# EAGLE schematic BMS (EAGLE 6.4)

## Sheet 1 of 8: LTC-6803-4 Circuit
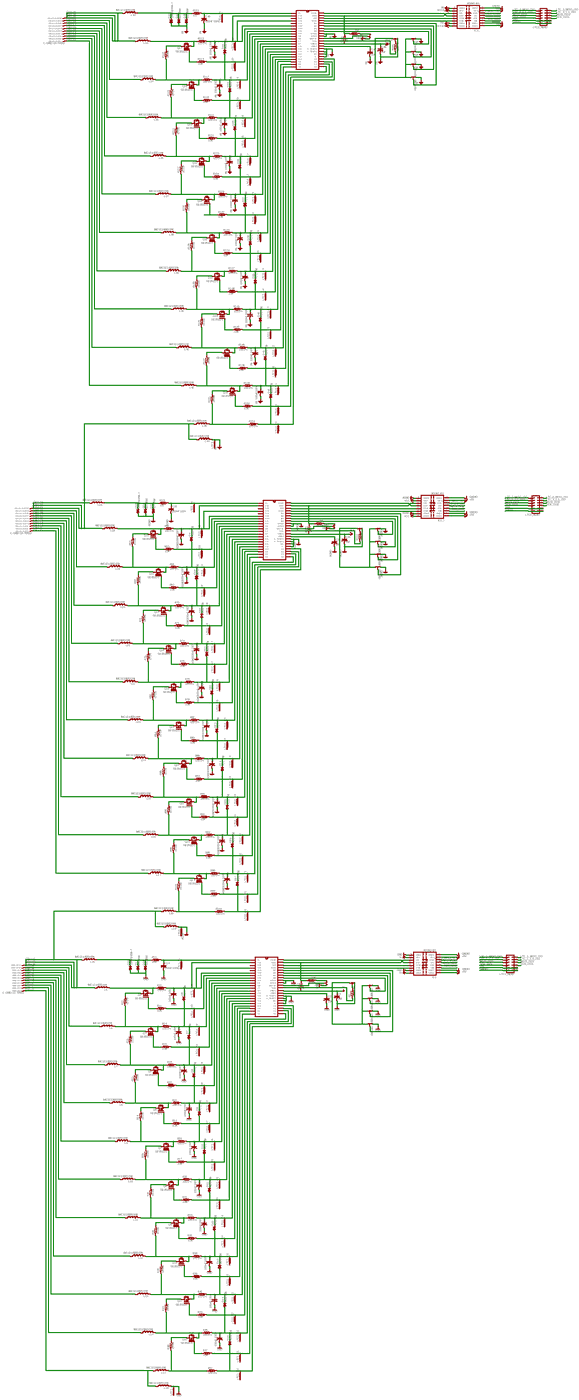
[diagram p0: schematic, sheet 1, overview]
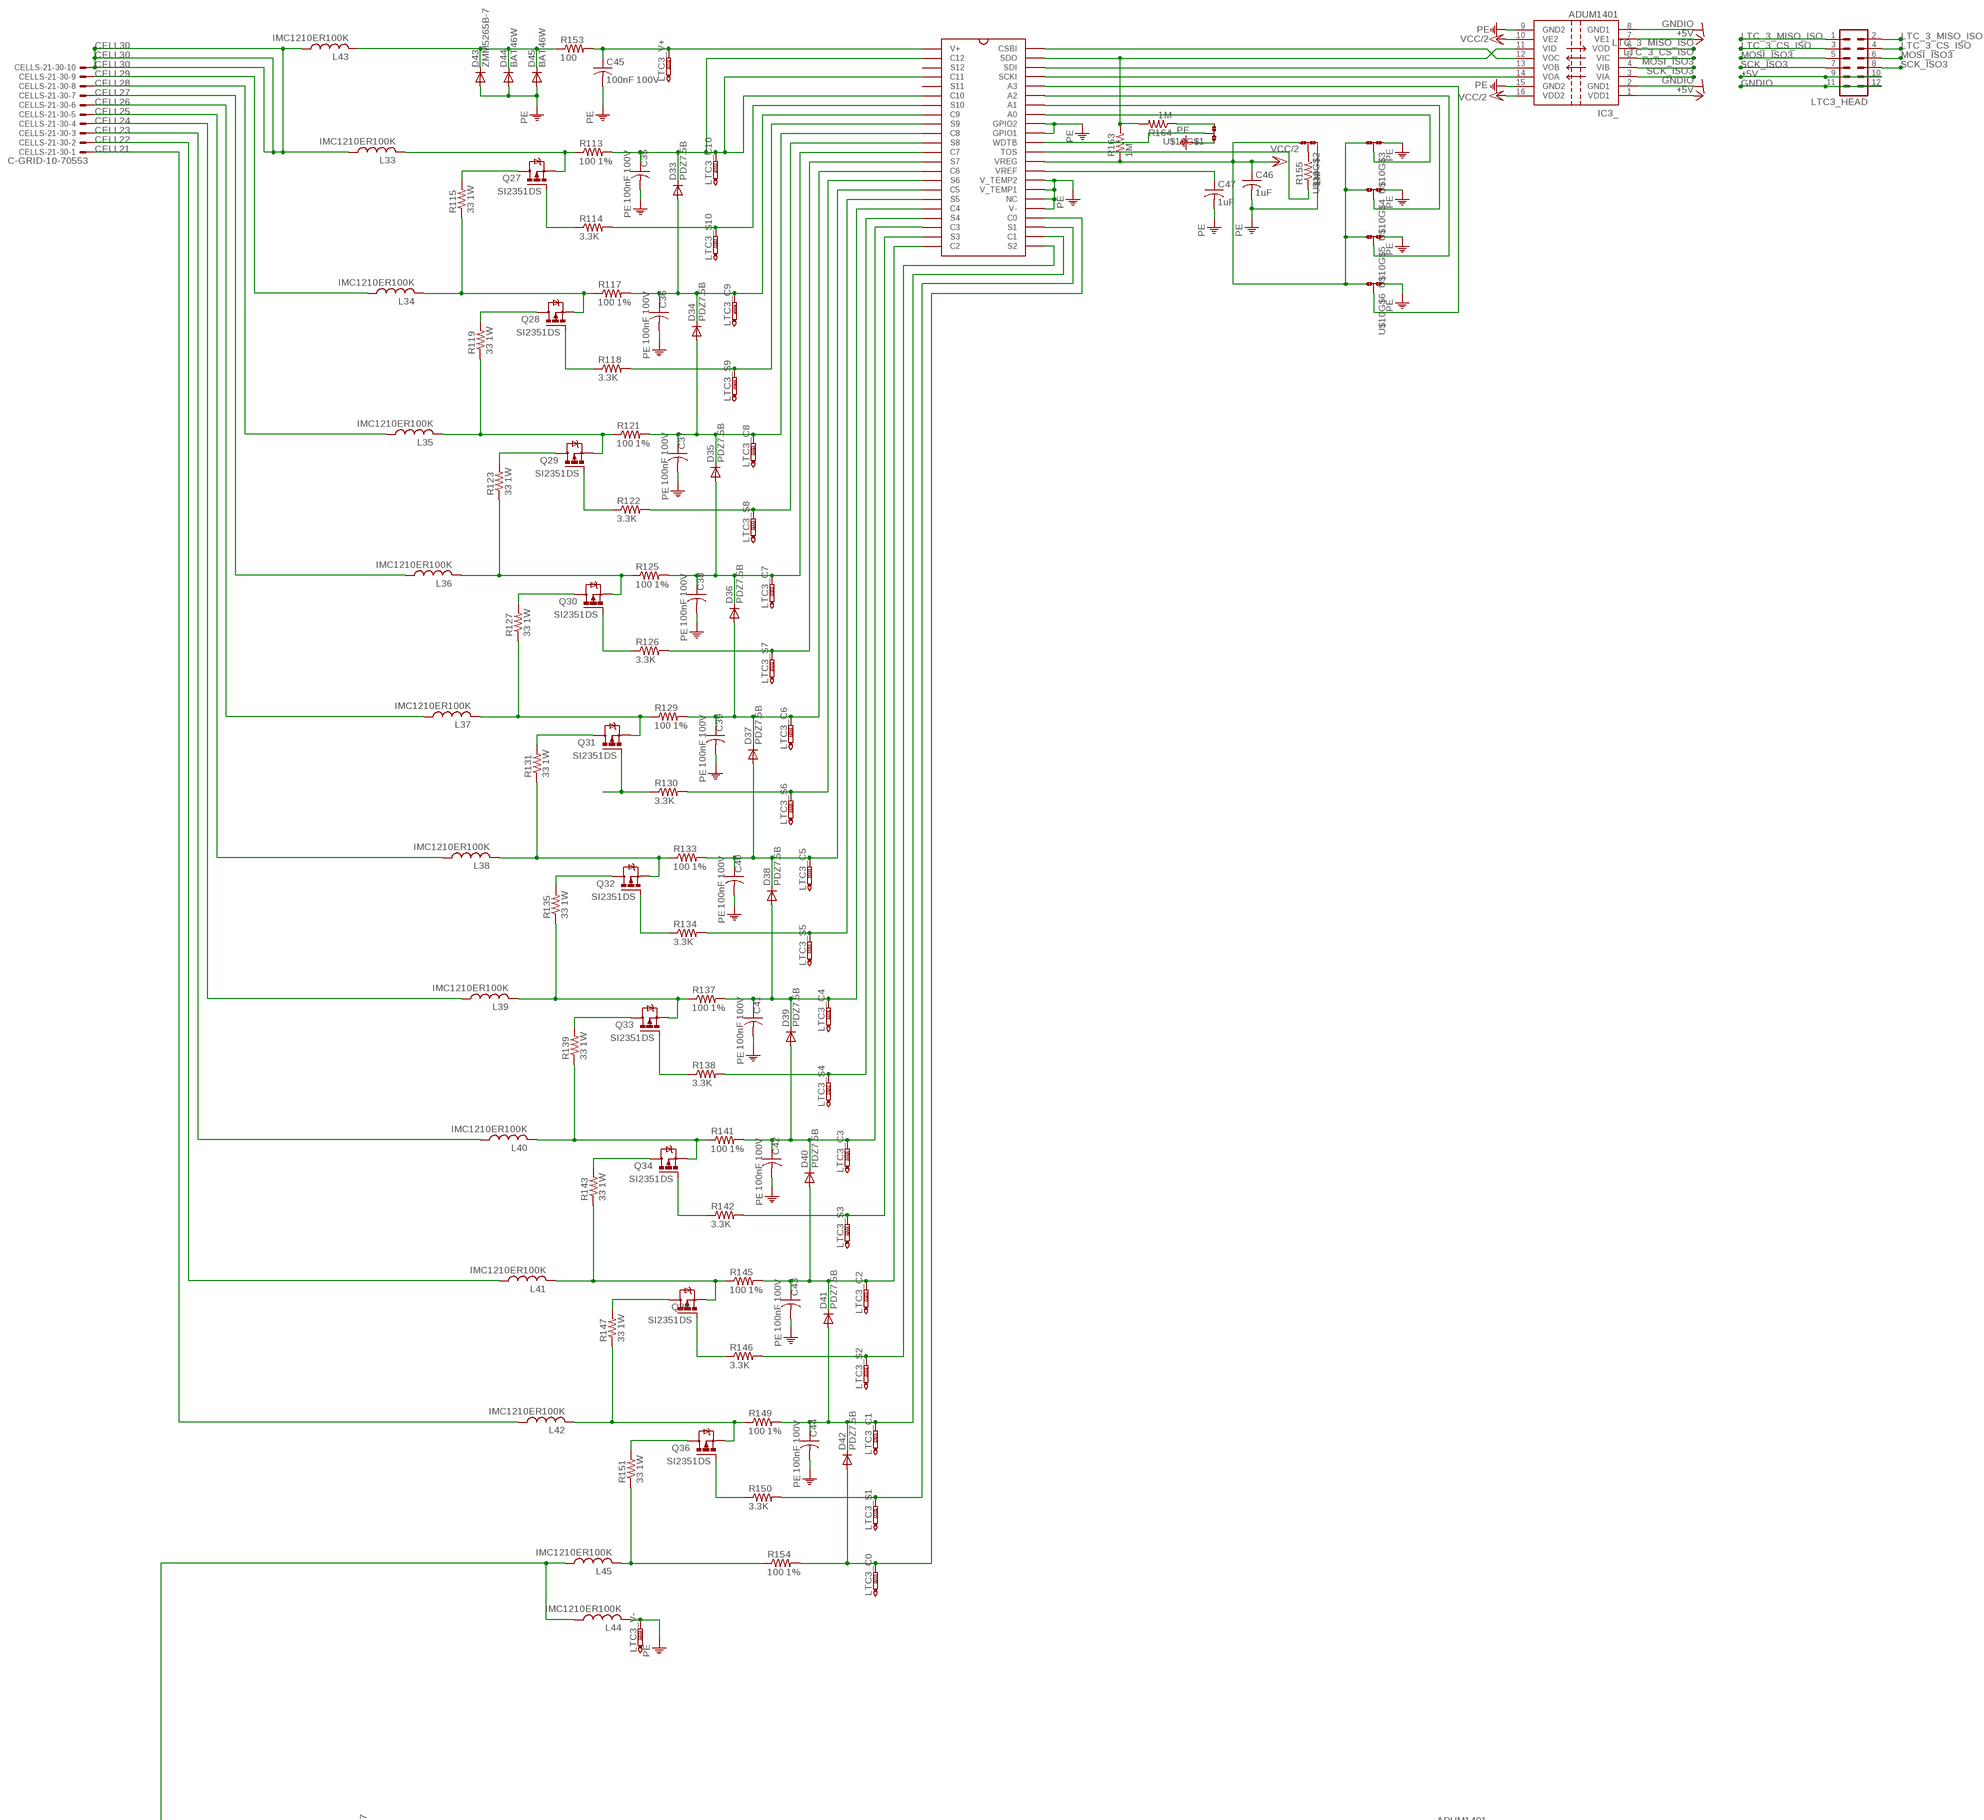
[diagram p1: schematic, sheet 1, part 1 of 4]
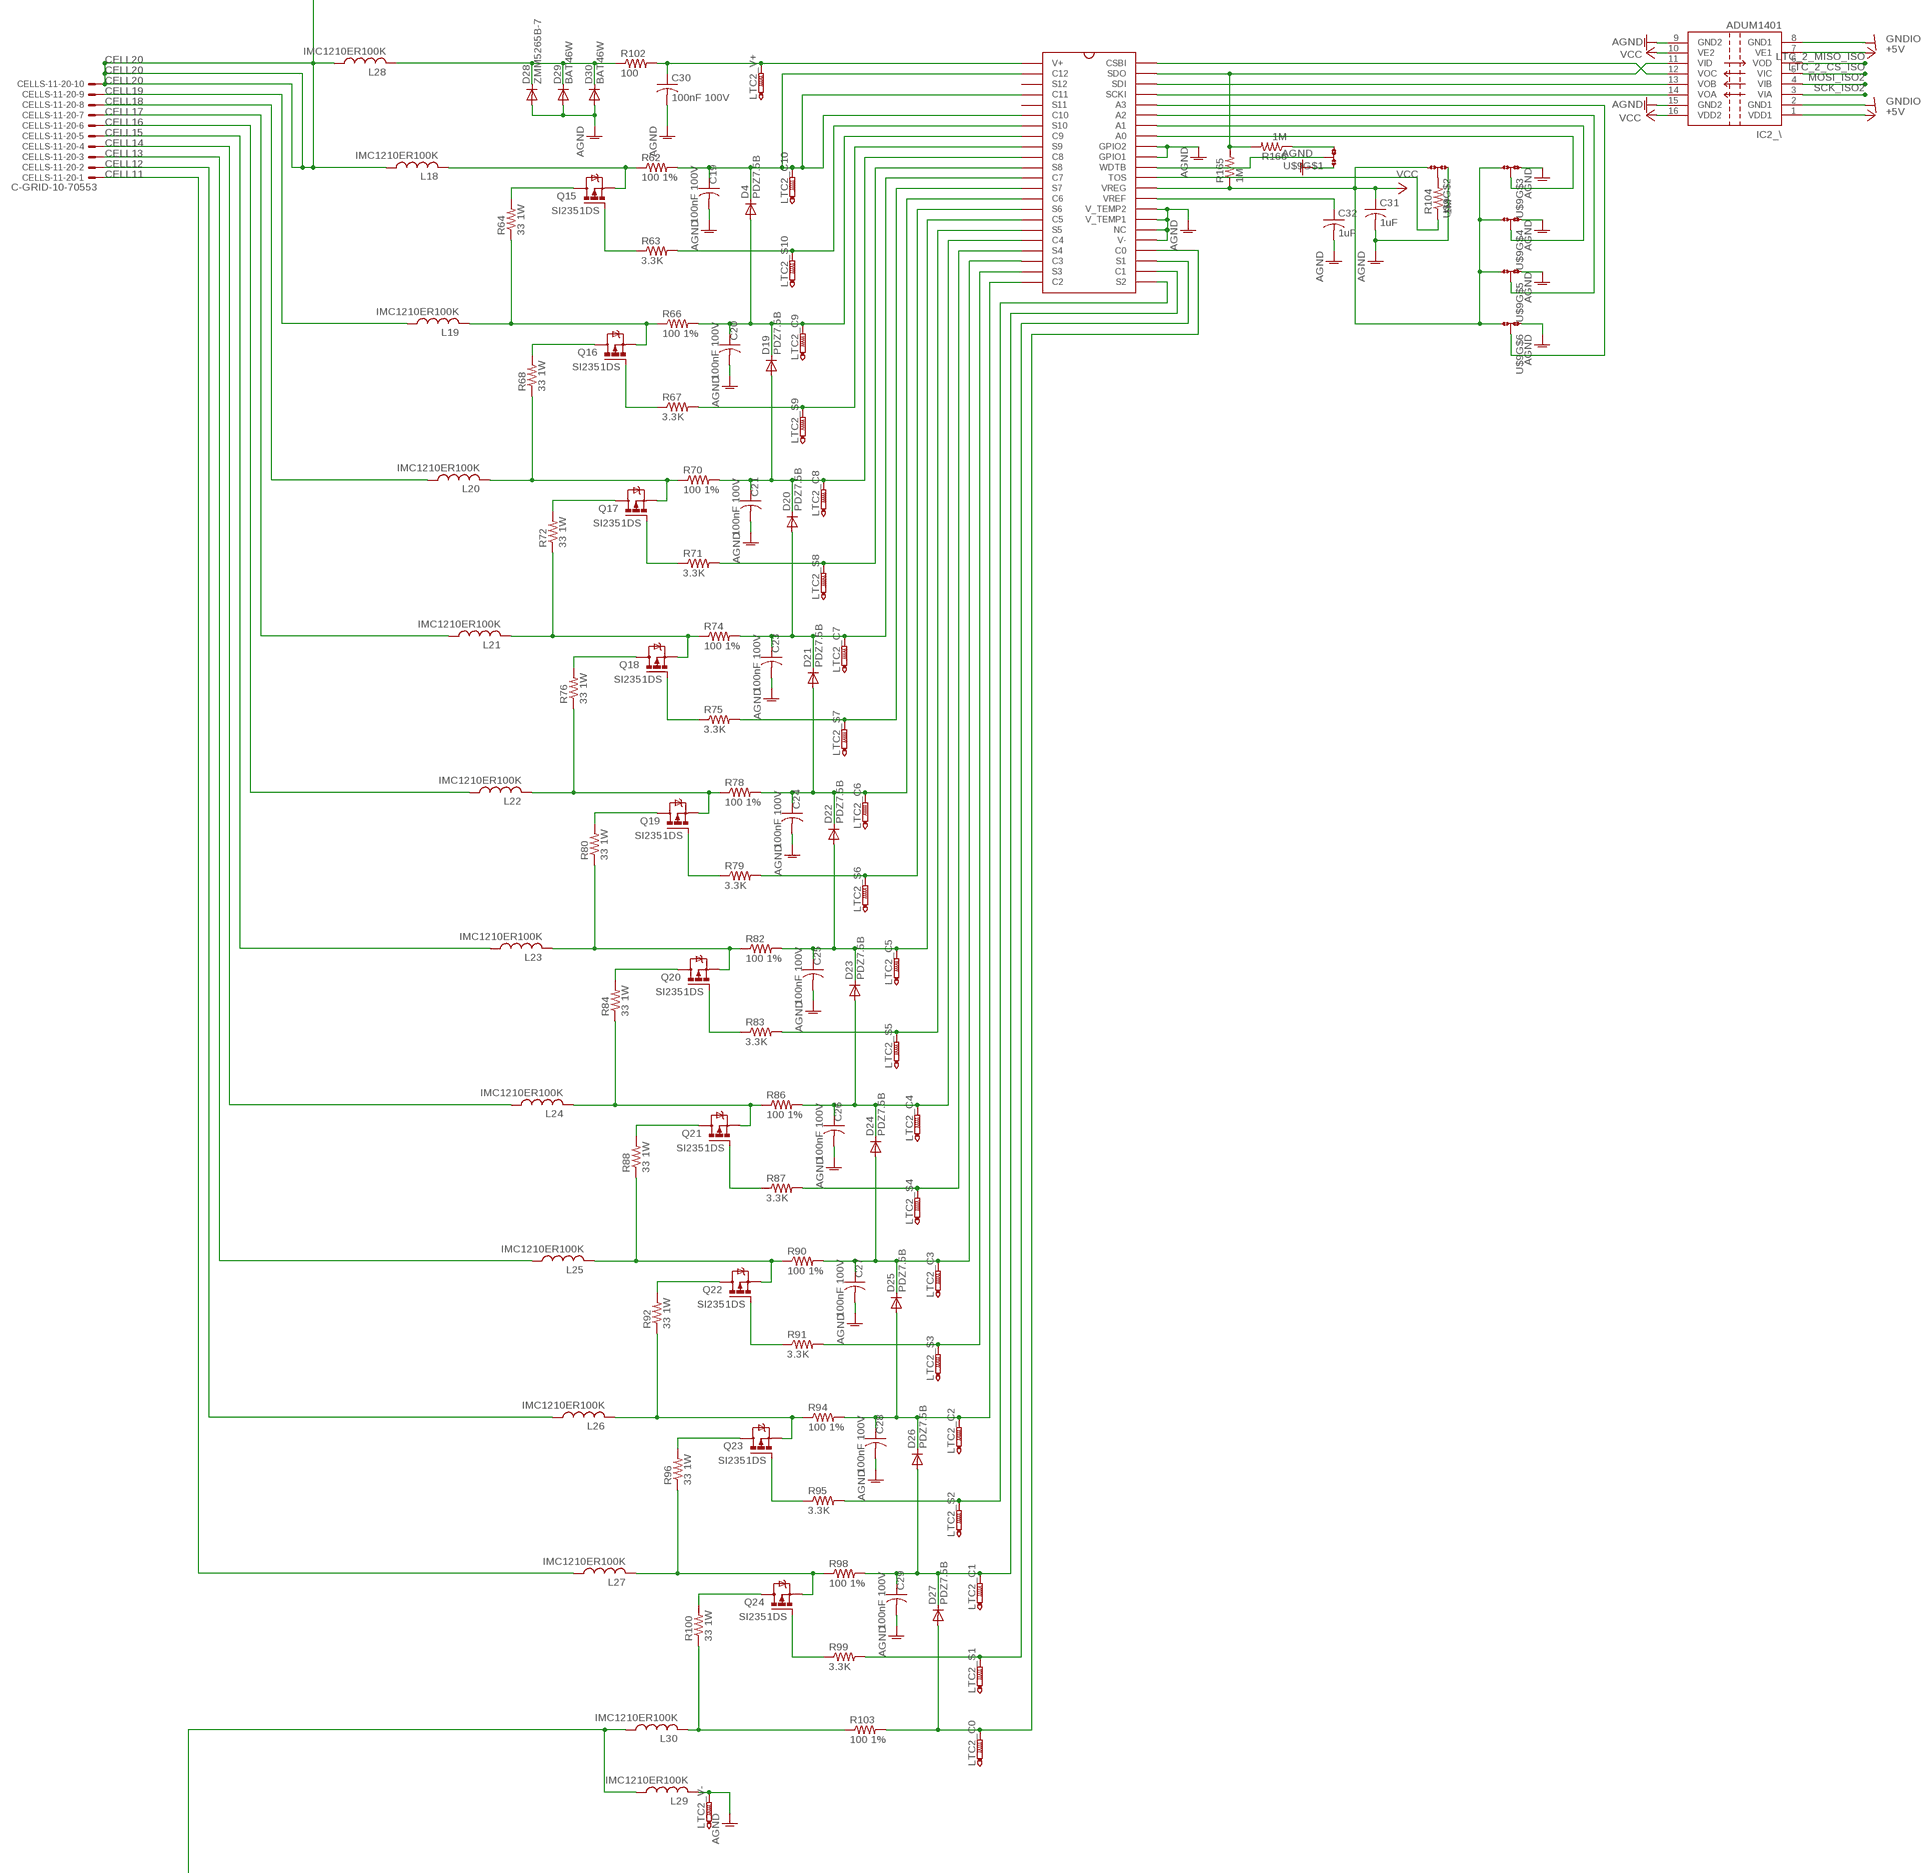
[diagram p2: schematic, sheet 1, part 2 of 4]
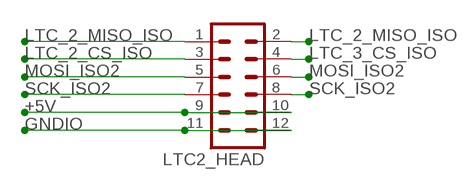
[diagram p3: schematic, sheet 1, part 3 of 4]
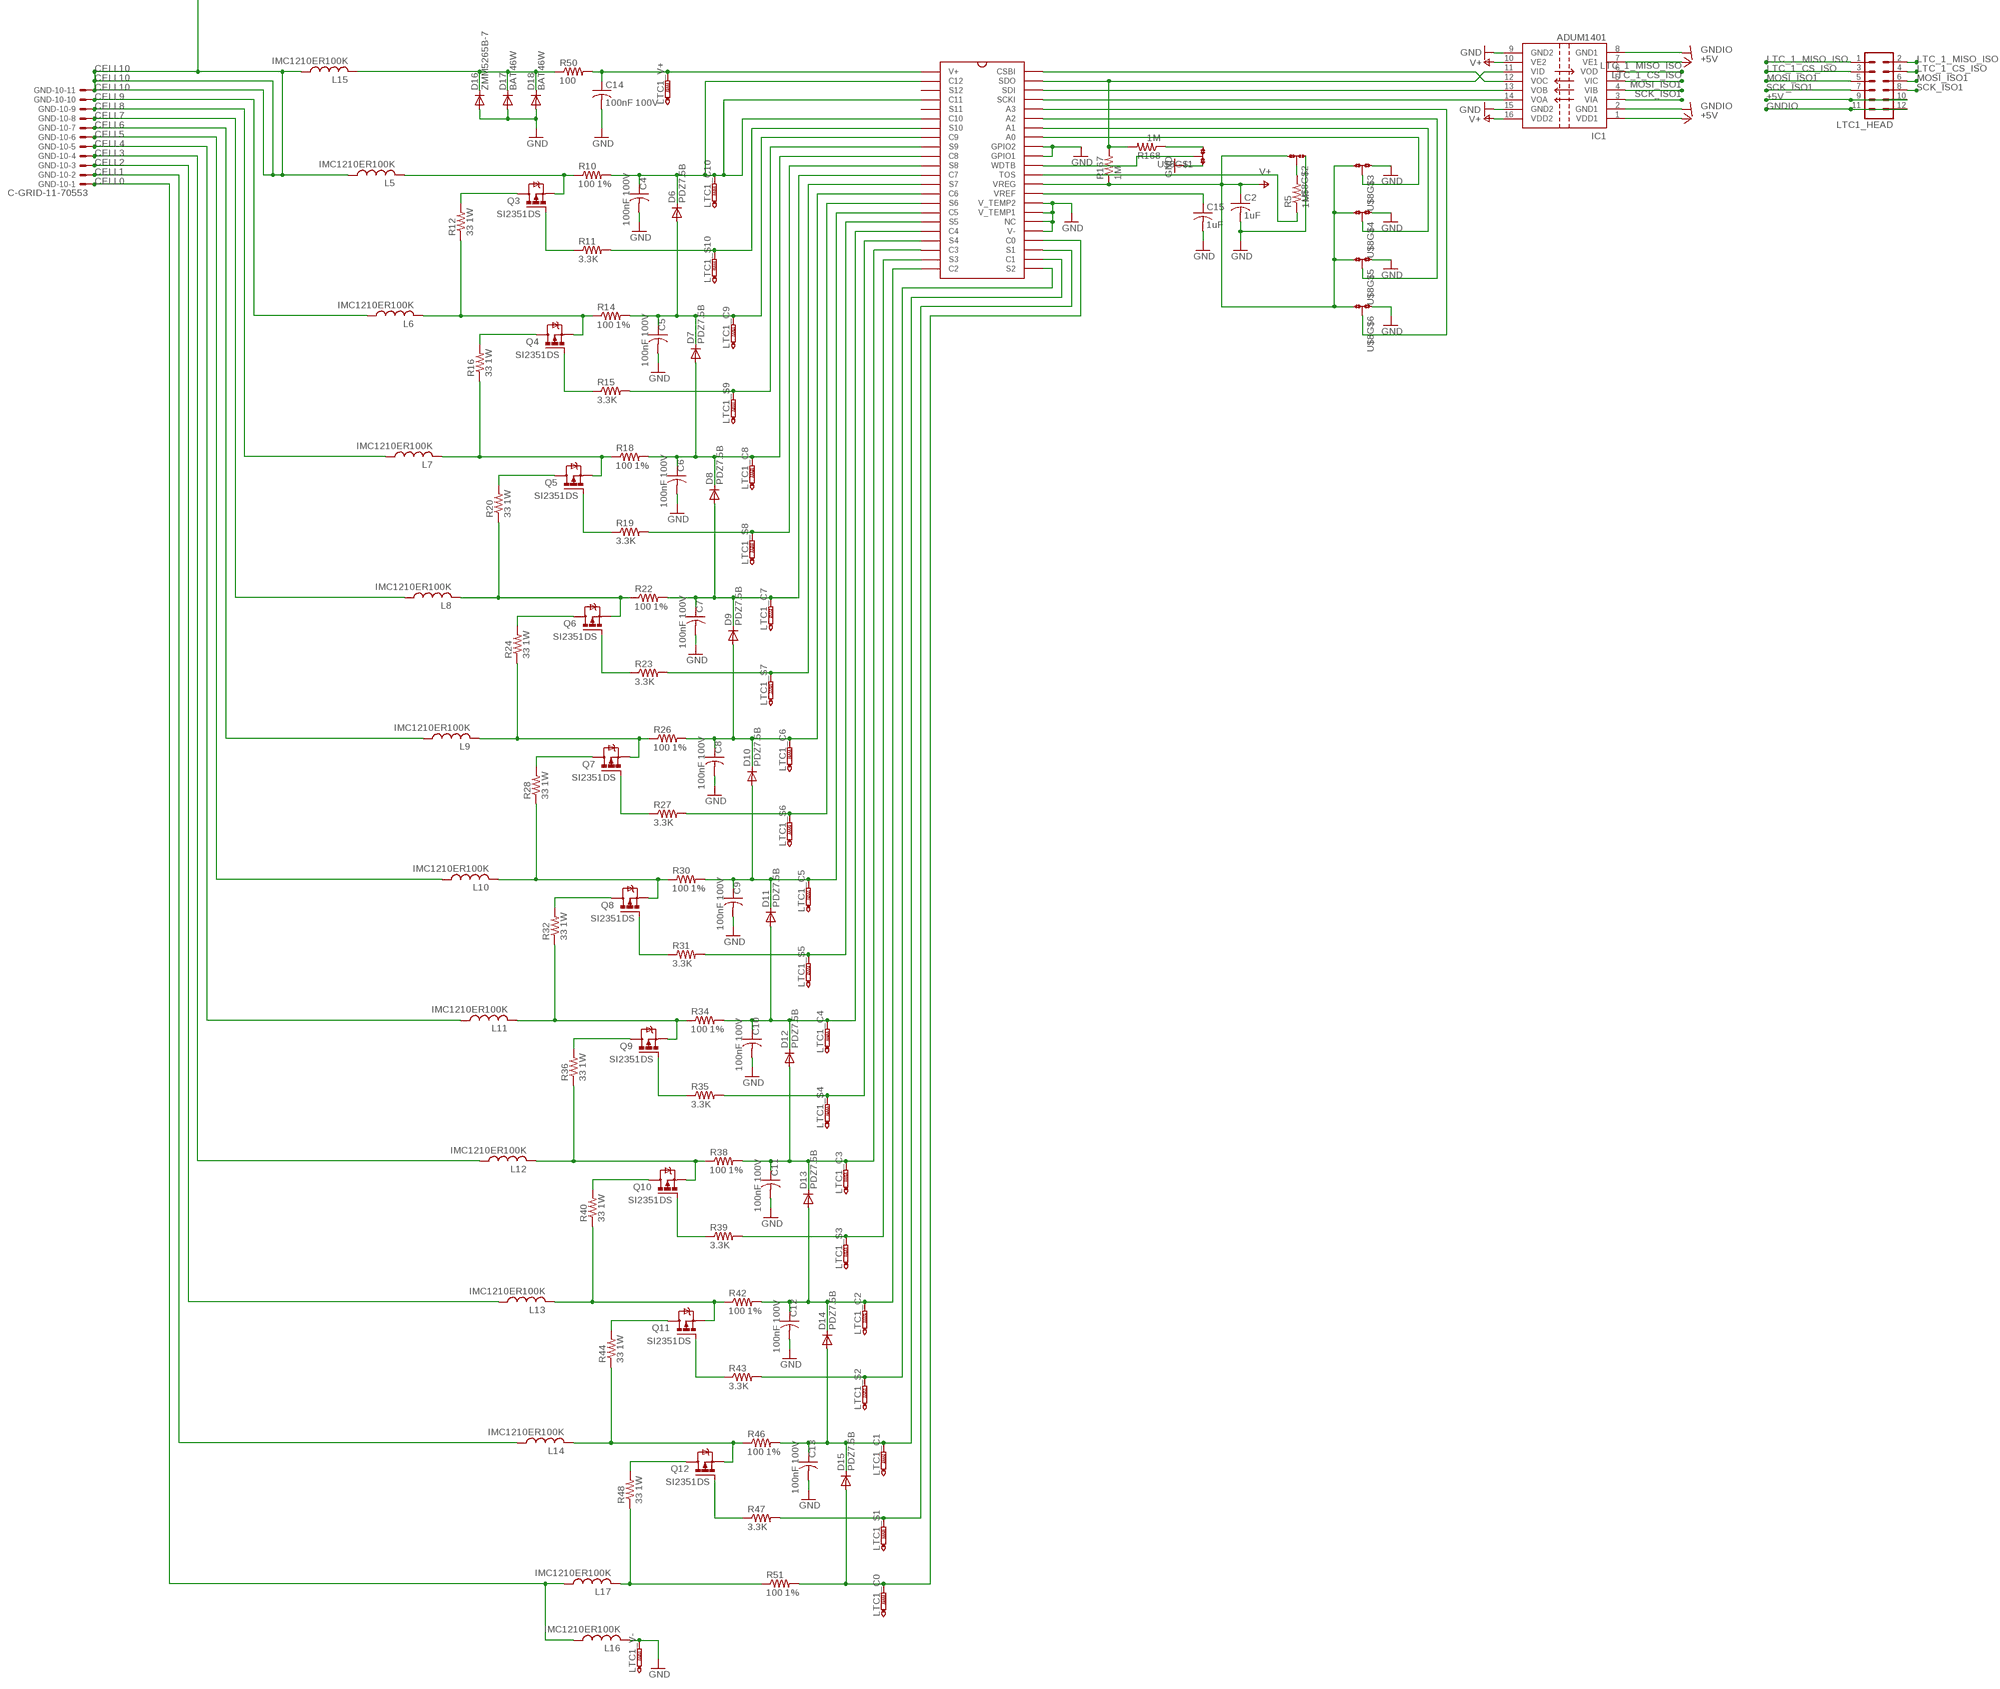
[diagram p4: schematic, sheet 1, part 4 of 4]

### Parts
C2  1uF  C-USC1206  [C1206]
C4  100nF 100V  C-USC1206  [C1206]
C5  100nF 100V  C-USC1206  [C1206]
C6  100nF 100V  C-USC1206  [C1206]
C7  100nF 100V  C-USC1206  [C1206]
C8  100nF 100V  C-USC1206  [C1206]
C9  100nF 100V  C-USC1206  [C1206]
C10  100nF 100V  C-USC1206  [C1206]
C11  100nF 100V  C-USC1206  [C1206]
C12  100nF 100V  C-USC1206  [C1206]
C13  100nF 100V  C-USC1206  [C1206]
C14  100nF 100V  C-USC1206  [C1206]
C15  1uF  C-USC1206  [C1206]
C19  100nF 100V  C-USC1206  [C1206]
C20  100nF 100V  C-USC1206  [C1206]
C21  100nF 100V  C-USC1206  [C1206]
C23  100nF 100V  C-USC1206  [C1206]
C24  100nF 100V  C-USC1206  [C1206]
C25  100nF 100V  C-USC1206  [C1206]
C26  100nF 100V  C-USC1206  [C1206]
C27  100nF 100V  C-USC1206  [C1206]
C28  100nF 100V  C-USC1206  [C1206]
C29  100nF 100V  C-USC1206  [C1206]
C30  100nF 100V  C-USC1206  [C1206]
C31  1uF  C-USC1206  [C1206]
C32  1uF  C-USC1206  [C1206]
C35  100nF 100V  C-USC1206  [C1206]
C36  100nF 100V  C-USC1206  [C1206]
C37  100nF 100V  C-USC1206  [C1206]
C38  100nF 100V  C-USC1206  [C1206]
C39  100nF 100V  C-USC1206  [C1206]
C40  100nF 100V  C-USC1206  [C1206]
C41  100nF 100V  C-USC1206  [C1206]
C42  100nF 100V  C-USC1206  [C1206]
C43  100nF 100V  C-USC1206  [C1206]
C44  100nF 100V  C-USC1206  [C1206]
C45  100nF 100V  C-USC1206  [C1206]
C46  1uF  C-USC1206  [C1206]
C47  1uF  C-USC1206  [C1206]
CELLS-11-20  C-GRID-10-70553  [70553-10]
CELLS-21-30  C-GRID-10-70553  [70553-10]
D4  PDZ7.5B  DIODE-SOD323-W  [SOD323-W]
D6  PDZ7.5B  DIODE-SOD323-W  [SOD323-W]
D7  PDZ7.5B  DIODE-SOD323-W  [SOD323-W]
D8  PDZ7.5B  DIODE-SOD323-W  [SOD323-W]
D9  PDZ7.5B  DIODE-SOD323-W  [SOD323-W]
D10  PDZ7.5B  DIODE-SOD323-W  [SOD323-W]
D11  PDZ7.5B  DIODE-SOD323-W  [SOD323-W]
D12  PDZ7.5B  DIODE-SOD323-W  [SOD323-W]
D13  PDZ7.5B  DIODE-SOD323-W  [SOD323-W]
D14  PDZ7.5B  DIODE-SOD323-W  [SOD323-W]
D15  PDZ7.5B  DIODE-SOD323-W  [SOD323-W]
D16  ZMM5265B-7  DIODE-MINIMELF  [MINIMELF]
D17  BAT46W  DIODE-SOD123  [SOD123]
D18  BAT46W  DIODE-SOD123  [SOD123]
D19  PDZ7.5B  DIODE-SOD323-W  [SOD323-W]
D20  PDZ7.5B  DIODE-SOD323-W  [SOD323-W]
D21  PDZ7.5B  DIODE-SOD323-W  [SOD323-W]
D22  PDZ7.5B  DIODE-SOD323-W  [SOD323-W]
D23  PDZ7.5B  DIODE-SOD323-W  [SOD323-W]
D24  PDZ7.5B  DIODE-SOD323-W  [SOD323-W]
D25  PDZ7.5B  DIODE-SOD323-W  [SOD323-W]
D26  PDZ7.5B  DIODE-SOD323-W  [SOD323-W]
D27  PDZ7.5B  DIODE-SOD323-W  [SOD323-W]
D28  ZMM5265B-7  DIODE-MINIMELF  [MINIMELF]
D29  BAT46W  DIODE-SOD123  [SOD123]
D30  BAT46W  DIODE-SOD123  [SOD123]
D33  PDZ7.5B  DIODE-SOD323-W  [SOD323-W]
D34  PDZ7.5B  DIODE-SOD323-W  [SOD323-W]
D35  PDZ7.5B  DIODE-SOD323-W  [SOD323-W]
D36  PDZ7.5B  DIODE-SOD323-W  [SOD323-W]
D37  PDZ7.5B  DIODE-SOD323-W  [SOD323-W]
D38  PDZ7.5B  DIODE-SOD323-W  [SOD323-W]
D39  PDZ7.5B  DIODE-SOD323-W  [SOD323-W]
D40  PDZ7.5B  DIODE-SOD323-W  [SOD323-W]
D41  PDZ7.5B  DIODE-SOD323-W  [SOD323-W]
D42  PDZ7.5B  DIODE-SOD323-W  [SOD323-W]
D43  ZMM5265B-7  DIODE-MINIMELF  [MINIMELF]
D44  BAT46W  DIODE-SOD123  [SOD123]
D45  BAT46W  DIODE-SOD123  [SOD123]
GND-10  C-GRID-11-70553  [70553-11]
IC1  ADUM1401  [SO16W]
IC2_\  ADUM1401  [SO16W]
IC3_  ADUM1401  [SO16W]
L5  IMC1210ER100K  L-USL3225M  [L3225M]
L6  IMC1210ER100K  L-USL3225M  [L3225M]
L7  IMC1210ER100K  L-USL3225M  [L3225M]
L8  IMC1210ER100K  L-USL3225M  [L3225M]
L9  IMC1210ER100K  L-USL3225M  [L3225M]
L10  IMC1210ER100K  L-USL3225M  [L3225M]
L11  IMC1210ER100K  L-USL3225M  [L3225M]
L12  IMC1210ER100K  L-USL3225M  [L3225M]
L13  IMC1210ER100K  L-USL3225M  [L3225M]
L14  IMC1210ER100K  L-USL3225M  [L3225M]
L15  IMC1210ER100K  L-USL3225M  [L3225M]
L16  IMC1210ER100K  L-USL3225M  [L3225M]
L17  IMC1210ER100K  L-USL3225M  [L3225M]
L18  IMC1210ER100K  L-USL3225M  [L3225M]
L19  IMC1210ER100K  L-USL3225M  [L3225M]
L20  IMC1210ER100K  L-USL3225M  [L3225M]
L21  IMC1210ER100K  L-USL3225M  [L3225M]
L22  IMC1210ER100K  L-USL3225M  [L3225M]
L23  IMC1210ER100K  L-USL3225M  [L3225M]
L24  IMC1210ER100K  L-USL3225M  [L3225M]
L25  IMC1210ER100K  L-USL3225M  [L3225M]
L26  IMC1210ER100K  L-USL3225M  [L3225M]
L27  IMC1210ER100K  L-USL3225M  [L3225M]
L28  IMC1210ER100K  L-USL3225M  [L3225M]
L29  IMC1210ER100K  L-USL3225M  [L3225M]
L30  IMC1210ER100K  L-USL3225M  [L3225M]
L33  IMC1210ER100K  L-USL3225M  [L3225M]
L34  IMC1210ER100K  L-USL3225M  [L3225M]
L35  IMC1210ER100K  L-USL3225M  [L3225M]
L36  IMC1210ER100K  L-USL3225M  [L3225M]
L37  IMC1210ER100K  L-USL3225M  [L3225M]
L38  IMC1210ER100K  L-USL3225M  [L3225M]
L39  IMC1210ER100K  L-USL3225M  [L3225M]
L40  IMC1210ER100K  L-USL3225M  [L3225M]
L41  IMC1210ER100K  L-USL3225M  [L3225M]
L42  IMC1210ER100K  L-USL3225M  [L3225M]
L43  IMC1210ER100K  L-USL3225M  [L3225M]
L44  IMC1210ER100K  L-USL3225M  [L3225M]
L45  IMC1210ER100K  L-USL3225M  [L3225M]
LTC1  LTC6803-4  [SSOP44]
LTC1_C0  TESTPAD-20MIL  [20MIL]
LTC1_C1  TESTPAD-20MIL  [20MIL]
LTC1_C2  TESTPAD-20MIL  [20MIL]
LTC1_C3  TESTPAD-20MIL  [20MIL]
LTC1_C4  TESTPAD-20MIL  [20MIL]
LTC1_C5  TESTPAD-20MIL  [20MIL]
LTC1_C6  TESTPAD-20MIL  [20MIL]
LTC1_C7  TESTPAD-20MIL  [20MIL]
LTC1_C8  TESTPAD-20MIL  [20MIL]
LTC1_C9  TESTPAD-20MIL  [20MIL]
LTC1_C10  TESTPAD-20MIL  [20MIL]
LTC1_HEAD  MA06-2  [MA06-2]
LTC1_S1  TESTPAD-20MIL  [20MIL]
LTC1_S2  TESTPAD-20MIL  [20MIL]
LTC1_S3  TESTPAD-20MIL  [20MIL]
LTC1_S4  TESTPAD-20MIL  [20MIL]
LTC1_S5  TESTPAD-20MIL  [20MIL]
LTC1_S6  TESTPAD-20MIL  [20MIL]
LTC1_S7  TESTPAD-20MIL  [20MIL]
LTC1_S8  TESTPAD-20MIL  [20MIL]
LTC1_S9  TESTPAD-20MIL  [20MIL]
LTC1_S10  TESTPAD-20MIL  [20MIL]
LTC1_V+  TESTPAD-20MIL  [20MIL]
LTC1_V-  TESTPAD-20MIL  [20MIL]
LTC2  LTC6803-4  [SSOP44]
LTC2_C0  TESTPAD-20MIL  [20MIL]
LTC2_C1  TESTPAD-20MIL  [20MIL]
LTC2_C2  TESTPAD-20MIL  [20MIL]
LTC2_C3  TESTPAD-20MIL  [20MIL]
LTC2_C4  TESTPAD-20MIL  [20MIL]
LTC2_C5  TESTPAD-20MIL  [20MIL]
LTC2_C6  TESTPAD-20MIL  [20MIL]
LTC2_C7  TESTPAD-20MIL  [20MIL]
LTC2_C8  TESTPAD-20MIL  [20MIL]
LTC2_C9  TESTPAD-20MIL  [20MIL]
LTC2_C10  TESTPAD-20MIL  [20MIL]
LTC2_HEAD  MA06-2  [MA06-2]
LTC2_S1  TESTPAD-20MIL  [20MIL]
LTC2_S2  TESTPAD-20MIL  [20MIL]
LTC2_S3  TESTPAD-20MIL  [20MIL]
LTC2_S4  TESTPAD-20MIL  [20MIL]
LTC2_S5  TESTPAD-20MIL  [20MIL]
LTC2_S6  TESTPAD-20MIL  [20MIL]
LTC2_S7  TESTPAD-20MIL  [20MIL]
LTC2_S8  TESTPAD-20MIL  [20MIL]
LTC2_S9  TESTPAD-20MIL  [20MIL]
LTC2_S10  TESTPAD-20MIL  [20MIL]
LTC2_V+  TESTPAD-20MIL  [20MIL]
LTC2_V-  TESTPAD-20MIL  [20MIL]
LTC3  LTC6803-4  [SSOP44]
LTC3_C0  TESTPAD-20MIL  [20MIL]
LTC3_C1  TESTPAD-20MIL  [20MIL]
LTC3_C2  TESTPAD-20MIL  [20MIL]
LTC3_C3  TESTPAD-20MIL  [20MIL]
LTC3_C4  TESTPAD-20MIL  [20MIL]
LTC3_C5  TESTPAD-20MIL  [20MIL]
LTC3_C6  TESTPAD-20MIL  [20MIL]
LTC3_C7  TESTPAD-20MIL  [20MIL]
LTC3_C8  TESTPAD-20MIL  [20MIL]
LTC3_C9  TESTPAD-20MIL  [20MIL]
LTC3_C10  TESTPAD-20MIL  [20MIL]
LTC3_HEAD  MA06-2  [MA06-2]
LTC3_S1  TESTPAD-20MIL  [20MIL]
LTC3_S2  TESTPAD-20MIL  [20MIL]
LTC3_S3  TESTPAD-20MIL  [20MIL]
LTC3_S4  TESTPAD-20MIL  [20MIL]
LTC3_S5  TESTPAD-20MIL  [20MIL]
LTC3_S6  TESTPAD-20MIL  [20MIL]
LTC3_S7  TESTPAD-20MIL  [20MIL]
LTC3_S8  TESTPAD-20MIL  [20MIL]
LTC3_S9  TESTPAD-20MIL  [20MIL]
LTC3_S10  TESTPAD-20MIL  [20MIL]
LTC3_V+  TESTPAD-20MIL  [20MIL]
LTC3_V-  TESTPAD-20MIL  [20MIL]
Q3  SI2351DS  IRLML5203  [MICRO3]
Q4  SI2351DS  IRLML5203  [MICRO3]
Q5  SI2351DS  IRLML5203  [MICRO3]
Q6  SI2351DS  IRLML5203  [MICRO3]
Q7  SI2351DS  IRLML5203  [MICRO3]
Q8  SI2351DS  IRLML5203  [MICRO3]
Q9  SI2351DS  IRLML5203  [MICRO3]
Q10  SI2351DS  IRLML5203  [MICRO3]
Q11  SI2351DS  IRLML5203  [MICRO3]
Q12  SI2351DS  IRLML5203  [MICRO3]
Q15  SI2351DS  IRLML5203  [MICRO3]
Q16  SI2351DS  IRLML5203  [MICRO3]
Q17  SI2351DS  IRLML5203  [MICRO3]
Q18  SI2351DS  IRLML5203  [MICRO3]
Q19  SI2351DS  IRLML5203  [MICRO3]
Q20  SI2351DS  IRLML5203  [MICRO3]
Q21  SI2351DS  IRLML5203  [MICRO3]
Q22  SI2351DS  IRLML5203  [MICRO3]
Q23  SI2351DS  IRLML5203  [MICRO3]
Q24  SI2351DS  IRLML5203  [MICRO3]
Q27  SI2351DS  IRLML5203  [MICRO3]
Q28  SI2351DS  IRLML5203  [MICRO3]
Q29  SI2351DS  IRLML5203  [MICRO3]
Q30  SI2351DS  IRLML5203  [MICRO3]
Q31  SI2351DS  IRLML5203  [MICRO3]
Q32  SI2351DS  IRLML5203  [MICRO3]
Q33  SI2351DS  IRLML5203  [MICRO3]
Q34  SI2351DS  IRLML5203  [MICRO3]
Q35  SI2351DS  IRLML5203  [MICRO3]
Q36  SI2351DS  IRLML5203  [MICRO3]
R5  1M  R-US_R1206  [R1206]
R10  100 1%  R-US_R1206  [R1206]
R11  3.3K  R-US_R1206  [R1206]
R12  33 1W  R-US_R2512  [R2512]
R14  100 1%  R-US_R1206  [R1206]
R15  3.3K  R-US_R1206  [R1206]
R16  33 1W  R-US_R2512  [R2512]
R18  100 1%  R-US_R1206  [R1206]
R19  3.3K  R-US_R1206  [R1206]
R20  33 1W  R-US_R2512  [R2512]
R22  100 1%  R-US_R1206  [R1206]
R23  3.3K  R-US_R1206  [R1206]
R24  33 1W  R-US_R2512  [R2512]
R26  100 1%  R-US_R1206  [R1206]
R27  3.3K  R-US_R1206  [R1206]
R28  33 1W  R-US_R2512  [R2512]
R30  100 1%  R-US_R1206  [R1206]
R31  3.3K  R-US_R1206  [R1206]
R32  33 1W  R-US_R2512  [R2512]
R34  100 1%  R-US_R1206  [R1206]
R35  3.3K  R-US_R1206  [R1206]
R36  33 1W  R-US_R2512  [R2512]
R38  100 1%  R-US_R1206  [R1206]
R39  3.3K  R-US_R1206  [R1206]
R40  33 1W  R-US_R2512  [R2512]
R42  100 1%  R-US_R1206  [R1206]
R43  3.3K  R-US_R1206  [R1206]
R44  33 1W  R-US_R2512  [R2512]
R46  100 1%  R-US_R1206  [R1206]
R47  3.3K  R-US_R1206  [R1206]
R48  33 1W  R-US_R2512  [R2512]
R50  100  R-US_R1206  [R1206]
R51  100 1%  R-US_R1206  [R1206]
R62  100 1%  R-US_R1206  [R1206]
R63  3.3K  R-US_R1206  [R1206]
R64  33 1W  R-US_R2512  [R2512]
R66  100 1%  R-US_R1206  [R1206]
R67  3.3K  R-US_R1206  [R1206]
R68  33 1W  R-US_R2512  [R2512]
R70  100 1%  R-US_R1206  [R1206]
R71  3.3K  R-US_R1206  [R1206]
R72  33 1W  R-US_R2512  [R2512]
R74  100 1%  R-US_R1206  [R1206]
R75  3.3K  R-US_R1206  [R1206]
R76  33 1W  R-US_R2512  [R2512]
R78  100 1%  R-US_R1206  [R1206]
R79  3.3K  R-US_R1206  [R1206]
R80  33 1W  R-US_R2512  [R2512]
R82  100 1%  R-US_R1206  [R1206]
R83  3.3K  R-US_R1206  [R1206]
R84  33 1W  R-US_R2512  [R2512]
R86  100 1%  R-US_R1206  [R1206]
R87  3.3K  R-US_R1206  [R1206]
R88  33 1W  R-US_R2512  [R2512]
R90  100 1%  R-US_R1206  [R1206]
R91  3.3K  R-US_R1206  [R1206]
R92  33 1W  R-US_R2512  [R2512]
R94  100 1%  R-US_R1206  [R1206]
R95  3.3K  R-US_R1206  [R1206]
R96  33 1W  R-US_R2512  [R2512]
R98  100 1%  R-US_R1206  [R1206]
R99  3.3K  R-US_R1206  [R1206]
R100  33 1W  R-US_R2512  [R2512]
R102  100  R-US_R1206  [R1206]
R103  100 1%  R-US_R1206  [R1206]
R104  1M  R-US_R1206  [R1206]
R113  100 1%  R-US_R1206  [R1206]
R114  3.3K  R-US_R1206  [R1206]
R115  33 1W  R-US_R2512  [R2512]
R117  100 1%  R-US_R1206  [R1206]
R118  3.3K  R-US_R1206  [R1206]
R119  33 1W  R-US_R2512  [R2512]
R121  100 1%  R-US_R1206  [R1206]
R122  3.3K  R-US_R1206  [R1206]
R123  33 1W  R-US_R2512  [R2512]
R125  100 1%  R-US_R1206  [R1206]
R126  3.3K  R-US_R1206  [R1206]
R127  33 1W  R-US_R2512  [R2512]
R129  100 1%  R-US_R1206  [R1206]
R130  3.3K  R-US_R1206  [R1206]
R131  33 1W  R-US_R2512  [R2512]
R133  100 1%  R-US_R1206  [R1206]
R134  3.3K  R-US_R1206  [R1206]
R135  33 1W  R-US_R2512  [R2512]
R137  100 1%  R-US_R1206  [R1206]
R138  3.3K  R-US_R1206  [R1206]
R139  33 1W  R-US_R2512  [R2512]
R141  100 1%  R-US_R1206  [R1206]
R142  3.3K  R-US_R1206  [R1206]
R143  33 1W  R-US_R2512  [R2512]
R145  100 1%  R-US_R1206  [R1206]
R146  3.3K  R-US_R1206  [R1206]
R147  33 1W  R-US_R2512  [R2512]
R149  100 1%  R-US_R1206  [R1206]
R150  3.3K  R-US_R1206  [R1206]
R151  33 1W  R-US_R2512  [R2512]
R153  100  R-US_R1206  [R1206]
R154  100 1%  R-US_R1206  [R1206]
R155  1M  R-US_R1206  [R1206]
R163  1M  R-US_R1206  [R1206]
R164  1M  R-US_R1206  [R1206]
R165  1M  R-US_R1206  [R1206]
R166  1M  R-US_R1206  [R1206]
R167  1M  R-US_R1206  [R1206]
R168  1M  R-US_R1206  [R1206]
U$8  3ROW_6POS  [3ROW_6POS]
U$9  3ROW_6POS  [3ROW_6POS]
U$10  3ROW_6POS  [3ROW_6POS]

### Nets
+5V: IC1.1(VDD1) IC1.7(VE1) IC2_\.1(VDD1) IC2_\.7(VE1) IC3_.1(VDD1) IC3_.7(VE1) LTC1_HEAD.9 LTC1_HEAD.10 LTC2_HEAD.9 LTC2_HEAD.10 LTC3_HEAD.9 LTC3_HEAD.10 ; also sheet 2,5,7
A0 [Mini]: LTC1.P$37(A0) U$8.8
A1 [Mini]: LTC1.P$38(A1) U$8.11
A2 [Mini]: LTC1.P$39(A2) U$8.14
A3 [Mini]: LTC1.P$40(A3) U$8.17
AGND [Mini]: C19.2 C20.2 C21.2 C23.2 C24.2 C25.2 C26.2 C27.2 C28.2 C29.2 C30.2 C31.2 C32.2 D28.A D29.A D30.A IC2_\.9(GND2) IC2_\.15(GND2) L29.2 LTC2.P$27(V-) LTC2.P$28(NC) LTC2.P$29(V_TEMP1) LTC2.P$30(V_TEMP2) LTC2.P$35(GPIO1) LTC2.P$36(GPIO2) LTC2_V-.P$1(TP) U$9.1 U$9.4 U$9.7 U$9.10 U$9.13 U$9.16
CELL0: GND-10.1 L16.1 L17.1
CELL1: GND-10.2 L14.1
CELL2: GND-10.3 L13.1
CELL3: GND-10.4 L12.1
CELL4: GND-10.5 L11.1
CELL5: GND-10.6 L10.1
CELL6: GND-10.7 L9.1
CELL7: GND-10.8 L8.1
CELL8: GND-10.9 L7.1
CELL9: GND-10.10 L6.1
CELL10: GND-10.11 L5.1 L15.1 L29.1 L30.1
CELL11: CELLS-11-20.1 L27.1
CELL12: CELLS-11-20.2 L26.1
CELL13: CELLS-11-20.3 L25.1
CELL14: CELLS-11-20.4 L24.1
CELL15: CELLS-11-20.5 L23.1
CELL16: CELLS-11-20.6 L22.1
CELL17: CELLS-11-20.7 L21.1
CELL18: CELLS-11-20.8 L20.1
CELL19: CELLS-11-20.9 L19.1
CELL20: CELLS-11-20.10 L18.1 L28.1 L44.1 L45.1
CELL21: CELLS-21-30.1 L42.1
CELL22: CELLS-21-30.2 L41.1
CELL23: CELLS-21-30.3 L40.1
CELL24: CELLS-21-30.4 L39.1
CELL25: CELLS-21-30.5 L38.1
CELL26: CELLS-21-30.6 L37.1
CELL27: CELLS-21-30.7 L36.1
CELL28: CELLS-21-30.8 L35.1
CELL29: CELLS-21-30.9 L34.1
CELL30: CELLS-21-30.10 L33.1 L43.1
GND [Mini]: C2.2 C4.2 C5.2 C6.2 C7.2 C8.2 C9.2 C10.2 C11.2 C12.2 C13.2 C14.2 C15.2 D16.A D17.A D18.A IC1.9(GND2) IC1.15(GND2) L16.2 LTC1.P$27(V-) LTC1.P$28(NC) LTC1.P$29(V_TEMP1) LTC1.P$30(V_TEMP2) LTC1.P$35(GPIO1) LTC1.P$36(GPIO2) LTC1_V-.P$1(TP) U$8.1 U$8.4 U$8.7 U$8.10 U$8.13 U$8.16
GNDIO: IC1.2(GND1) IC1.8(GND1) IC2_\.2(GND1) IC2_\.8(GND1) IC3_.2(GND1) IC3_.8(GND1) LTC1_HEAD.11 LTC1_HEAD.12 LTC2_HEAD.11 LTC2_HEAD.12 LTC3_HEAD.11 LTC3_HEAD.12 ; also sheet 2,3,4,5,6,7,8
LTC_1_CS_ISO: IC1.5(VIC) LTC1_HEAD.3 LTC1_HEAD.4
LTC_1_MISO_ISO: IC1.6(VOD) LTC1_HEAD.1 LTC1_HEAD.2
LTC_2_CS_ISO: IC2_\.5(VIC) LTC2_HEAD.3
LTC_2_MISO_ISO: IC2_\.6(VOD) LTC2_HEAD.1 LTC2_HEAD.2
LTC_3_CS_ISO: IC3_.5(VIC) LTC2_HEAD.4 LTC3_HEAD.3 LTC3_HEAD.4
LTC_3_MISO_ISO: IC3_.6(VOD) LTC3_HEAD.1 LTC3_HEAD.2
MOSI_ISO1: IC1.4(VIB) LTC1_HEAD.5 LTC1_HEAD.6
MOSI_ISO2: IC2_\.4(VIB) LTC2_HEAD.5 LTC2_HEAD.6
MOSI_ISO3: IC3_.4(VIB) LTC3_HEAD.5 LTC3_HEAD.6
N$2: R104.2 U$9.5
N$5: R155.2 U$10.5
N$9 [Mini]: C4.1 D6.C LTC1.P$2(C12) LTC1.P$4(C11) LTC1.P$6(C10) LTC1_C10.P$1(TP) R10.2
N$10: R5.2 U$8.5
N$20: L5.2 Q3.2(S) R10.1
N$21 [Mini]: IC1.12(VOC) LTC1.P$44(CSBI)
N$23 [Mini]: IC1.13(VOB) LTC1.P$42(SDI)
N$24 [Mini]: IC1.14(VOA) LTC1.P$41(SCKI)
N$25 [Mini]: LTC1.P$7(S10) LTC1_S10.P$1(TP) R11.2
N$26: Q3.1(G) R11.1
N$27: Q3.3(D) R12.2
N$29: L6.2 Q4.2(S) R12.1 R14.1
N$30 [Mini]: C15.1 LTC1.P$31(VREF)
N$31 [Mini]: C5.1 D6.A D7.C LTC1.P$8(C9) LTC1_C9.P$1(TP) R14.2
N$34 [Mini]: LTC1.P$9(S9) LTC1_S9.P$1(TP) R15.2
N$35: Q4.1(G) R15.1
N$36: Q4.3(D) R16.2
N$38: L7.2 Q5.2(S) R16.1 R18.1
N$40 [Mini]: C6.1 D7.A D8.C LTC1.P$10(C8) LTC1_C8.P$1(TP) R18.2
N$43 [Mini]: LTC1.P$11(S8) LTC1_S8.P$1(TP) R19.2
N$44: Q5.1(G) R19.1
N$45: Q5.3(D) R20.2
N$47: L8.2 Q6.2(S) R20.1 R22.1
N$49 [Mini]: C7.1 D8.A D9.C LTC1.P$12(C7) LTC1_C7.P$1(TP) R22.2
N$52 [Mini]: LTC1.P$13(S7) LTC1_S7.P$1(TP) R23.2
N$53: Q6.1(G) R23.1
N$54: Q6.3(D) R24.2
N$56: L9.2 Q7.2(S) R24.1 R26.1
N$58 [Mini]: C8.1 D9.A D10.C LTC1.P$14(C6) LTC1_C6.P$1(TP) R26.2
N$59 [Mini]: C19.1 D4.C LTC2.P$2(C12) LTC2.P$4(C11) LTC2.P$6(C10) LTC2_C10.P$1(TP) R62.2
N$61 [Mini]: LTC1.P$15(S6) LTC1_S6.P$1(TP) R27.2
N$62: Q7.1(G) R27.1
N$63: Q7.3(D) R28.2
N$65: L10.2 Q8.2(S) R28.1 R30.1
N$67 [Mini]: C9.1 D10.A D11.C LTC1.P$16(C5) LTC1_C5.P$1(TP) R30.2
N$70 [Mini]: LTC1.P$17(S5) LTC1_S5.P$1(TP) R31.2
N$71: Q8.1(G) R31.1
N$72: Q8.3(D) R32.2
N$74: L11.2 Q9.2(S) R32.1 R34.1
N$75: L18.2 Q15.2(S) R62.1
N$76 [Mini]: C10.1 D11.A D12.C LTC1.P$18(C4) LTC1_C4.P$1(TP) R34.2
N$78 [Mini]: LTC2.P$7(S10) LTC2_S10.P$1(TP) R63.2
N$79 [Mini]: LTC1.P$19(S4) LTC1_S4.P$1(TP) R35.2
N$80: Q9.1(G) R35.1
N$81: Q9.3(D) R36.2
N$83: L12.2 Q10.2(S) R36.1 R38.1
N$84: Q15.1(G) R63.1
N$85 [Mini]: C11.1 D12.A D13.C LTC1.P$20(C3) LTC1_C3.P$1(TP) R38.2
N$86: Q15.3(D) R64.2
N$88 [Mini]: LTC1.P$21(S3) LTC1_S3.P$1(TP) R39.2
N$89: Q10.1(G) R39.1
N$90: Q10.3(D) R40.2
N$92: L13.2 Q11.2(S) R40.1 R42.1
N$93: L19.2 Q16.2(S) R64.1 R66.1
N$94 [Mini]: C12.1 D13.A D14.C LTC1.P$22(C2) LTC1_C2.P$1(TP) R42.2
N$95 [Mini]: C20.1 D4.A D19.C LTC2.P$8(C9) LTC2_C9.P$1(TP) R66.2
N$96 [Mini]: LTC2.P$9(S9) LTC2_S9.P$1(TP) R67.2
N$97 [Mini]: LTC1.P$23(S2) LTC1_S2.P$1(TP) R43.2
N$98: Q11.1(G) R43.1
N$99: Q11.3(D) R44.2
N$101: L14.2 Q12.2(S) R44.1 R46.1
N$102: Q16.1(G) R67.1
N$103 [Mini]: C13.1 D14.A D15.C LTC1.P$24(C1) LTC1_C1.P$1(TP) R46.2
N$104: Q16.3(D) R68.2
N$106 [Mini]: LTC1.P$25(S1) LTC1_S1.P$1(TP) R47.2
N$107: Q12.1(G) R47.1
N$108: Q12.3(D) R48.2
N$110: L17.2 R48.1 R51.1
N$111: L20.2 Q17.2(S) R68.1 R70.1
N$112 [Mini]: D15.A LTC1.P$26(C0) LTC1_C0.P$1(TP) R51.2
N$113 [Mini]: C21.1 D19.A D20.C LTC2.P$10(C8) LTC2_C8.P$1(TP) R70.2
N$114: D16.C D17.C D18.C L15.2 R50.1
N$115 [Mini]: C14.1 LTC1.P$1(V+) LTC1_V+.P$1(TP) R50.2
N$116 [Mini]: LTC2.P$11(S8) LTC2_S8.P$1(TP) R71.2
N$117: Q17.1(G) R71.1
N$118: Q17.3(D) R72.2
N$120: L21.2 Q18.2(S) R72.1 R74.1
N$121 [Mini]: C23.1 D20.A D21.C LTC2.P$12(C7) LTC2_C7.P$1(TP) R74.2
N$122 [Mini]: LTC2.P$13(S7) LTC2_S7.P$1(TP) R75.2
N$123: Q18.1(G) R75.1
N$124: Q18.3(D) R76.2
N$126: L22.2 Q19.2(S) R76.1 R78.1
N$127 [Mini]: C24.1 D21.A D22.C LTC2.P$14(C6) LTC2_C6.P$1(TP) R78.2
N$128 [Mini]: LTC2.P$15(S6) LTC2_S6.P$1(TP) R79.2
N$129: Q19.1(G) R79.1
N$130: Q19.3(D) R80.2
N$132: L23.2 Q20.2(S) R80.1 R82.1
N$133 [Mini]: C25.1 D22.A D23.C LTC2.P$16(C5) LTC2_C5.P$1(TP) R82.2
N$134 [Mini]: LTC2.P$17(S5) LTC2_S5.P$1(TP) R83.2
N$135: Q20.1(G) R83.1
N$136: Q20.3(D) R84.2
N$138: L24.2 Q21.2(S) R84.1 R86.1
N$139 [Mini]: C26.1 D23.A D24.C LTC2.P$18(C4) LTC2_C4.P$1(TP) R86.2
N$140 [Mini]: LTC2.P$19(S4) LTC2_S4.P$1(TP) R87.2
N$141: Q21.1(G) R87.1
N$142: Q21.3(D) R88.2
N$144: L25.2 Q22.2(S) R88.1 R90.1
N$145 [Mini]: C27.1 D24.A D25.C LTC2.P$20(C3) LTC2_C3.P$1(TP) R90.2
N$146 [Mini]: LTC2.P$21(S3) LTC2_S3.P$1(TP) R91.2
N$147: Q22.1(G) R91.1
N$148: Q22.3(D) R92.2
N$150: L26.2 Q23.2(S) R92.1 R94.1
N$151 [Mini]: C28.1 D25.A D26.C LTC2.P$22(C2) LTC2_C2.P$1(TP) R94.2
N$152 [Mini]: LTC2.P$23(S2) LTC2_S2.P$1(TP) R95.2
N$153: Q23.1(G) R95.1
N$154: Q23.3(D) R96.2
N$156: L27.2 Q24.2(S) R96.1 R98.1
N$157 [Mini]: C29.1 D26.A D27.C LTC2.P$24(C1) LTC2_C1.P$1(TP) R98.2
N$158 [Mini]: LTC2.P$25(S1) LTC2_S1.P$1(TP) R99.2
N$159: Q24.1(G) R99.1
N$160: Q24.3(D) R100.2
N$162: L30.2 R100.1 R103.1
N$163 [Mini]: D27.A LTC2.P$26(C0) LTC2_C0.P$1(TP) R103.2
N$164: D28.C D29.C D30.C L28.2 R102.1
N$165 [Mini]: C30.1 LTC2.P$1(V+) LTC2_V+.P$1(TP) R102.2
N$167 [Mini]: LTC2.P$33(TOS) R104.1
N$168 [Mini]: LTC2.P$39(A2) U$9.14
N$169 [Mini]: LTC2.P$40(A3) U$9.17
N$170 [Mini]: LTC2.P$38(A1) U$9.11
N$171 [Mini]: LTC2.P$37(A0) U$9.8
N$173 [Mini]: IC2_\.12(VOC) LTC2.P$44(CSBI)
N$174 [Mini]: IC2_\.13(VOB) LTC2.P$42(SDI)
N$175 [Mini]: IC2_\.14(VOA) LTC2.P$41(SCKI)
N$176 [Mini]: C32.1 LTC2.P$31(VREF)
N$184 [Mini]: C35.1 D33.C LTC3.P$2(C12) LTC3.P$4(C11) LTC3.P$6(C10) LTC3_C10.P$1(TP) R113.2
N$189: L33.2 Q27.2(S) R113.1
N$191 [Mini]: LTC3.P$7(S10) LTC3_S10.P$1(TP) R114.2
N$192: Q27.1(G) R114.1
N$193: Q27.3(D) R115.2
N$195: L34.2 Q28.2(S) R115.1 R117.1
N$196 [Mini]: C36.1 D33.A D34.C LTC3.P$8(C9) LTC3_C9.P$1(TP) R117.2
N$197 [Mini]: LTC3.P$9(S9) LTC3_S9.P$1(TP) R118.2
N$198: Q28.1(G) R118.1
N$199: Q28.3(D) R119.2
N$201: L35.2 Q29.2(S) R119.1 R121.1
N$202 [Mini]: C37.1 D34.A D35.C LTC3.P$10(C8) LTC3_C8.P$1(TP) R121.2
N$203 [Mini]: LTC3.P$11(S8) LTC3_S8.P$1(TP) R122.2
N$204: Q29.1(G) R122.1
N$205: Q29.3(D) R123.2
N$207: L36.2 Q30.2(S) R123.1 R125.1
N$208 [Mini]: C38.1 D35.A D36.C LTC3.P$12(C7) LTC3_C7.P$1(TP) R125.2
N$209 [Mini]: LTC3.P$13(S7) LTC3_S7.P$1(TP) R126.2
N$210: Q30.1(G) R126.1
N$211: Q30.3(D) R127.2
N$213: L37.2 Q31.2(S) R127.1 R129.1
N$214 [Mini]: C39.1 D36.A D37.C LTC3.P$14(C6) LTC3_C6.P$1(TP) R129.2
N$215 [Mini]: LTC3.P$15(S6) LTC3_S6.P$1(TP) R130.2
N$216: Q31.1(G) R130.1
N$217: Q31.3(D) R131.2
N$219: L38.2 Q32.2(S) R131.1 R133.1
N$220 [Mini]: C40.1 D37.A D38.C LTC3.P$16(C5) LTC3_C5.P$1(TP) R133.2
N$221 [Mini]: LTC3.P$17(S5) LTC3_S5.P$1(TP) R134.2
N$222: Q32.1(G) R134.1
N$223: Q32.3(D) R135.2
N$225: L39.2 Q33.2(S) R135.1 R137.1
N$226 [Mini]: C41.1 D38.A D39.C LTC3.P$18(C4) LTC3_C4.P$1(TP) R137.2
N$227 [Mini]: LTC3.P$19(S4) LTC3_S4.P$1(TP) R138.2
N$228: Q33.1(G) R138.1
N$229: Q33.3(D) R139.2
N$231: L40.2 Q34.2(S) R139.1 R141.1
N$232 [Mini]: C42.1 D39.A D40.C LTC3.P$20(C3) LTC3_C3.P$1(TP) R141.2
N$233 [Mini]: LTC3.P$21(S3) LTC3_S3.P$1(TP) R142.2
N$234: Q34.1(G) R142.1
N$235: Q34.3(D) R143.2
N$237: L41.2 Q35.2(S) R143.1 R145.1
N$238 [Mini]: C43.1 D40.A D41.C LTC3.P$22(C2) LTC3_C2.P$1(TP) R145.2
N$239 [Mini]: LTC3.P$23(S2) LTC3_S2.P$1(TP) R146.2
N$240: Q35.1(G) R146.1
N$241: Q35.3(D) R147.2
N$243: L42.2 Q36.2(S) R147.1 R149.1
N$244 [Mini]: C44.1 D41.A D42.C LTC3.P$24(C1) LTC3_C1.P$1(TP) R149.2
N$245 [Mini]: LTC3.P$25(S1) LTC3_S1.P$1(TP) R150.2
N$246: Q36.1(G) R150.1
N$247: Q36.3(D) R151.2
N$249: L45.2 R151.1 R154.1
N$250 [Mini]: D42.A LTC3.P$26(C0) LTC3_C0.P$1(TP) R154.2
N$251: D43.C D44.C D45.C L43.2 R153.1
N$252 [Mini]: C45.1 LTC3.P$1(V+) LTC3_V+.P$1(TP) R153.2
N$254 [Mini]: LTC3.P$33(TOS) R155.1
N$255 [Mini]: LTC3.P$39(A2) U$10.14
N$256 [Mini]: LTC3.P$40(A3) U$10.17
N$257 [Mini]: LTC3.P$38(A1) U$10.11
N$258 [Mini]: LTC3.P$37(A0) U$10.8
N$260 [Mini]: IC3_.12(VOC) LTC3.P$44(CSBI)
N$261 [Mini]: IC3_.13(VOB) LTC3.P$42(SDI)
N$262 [Mini]: IC3_.14(VOA) LTC3.P$41(SCKI)
N$263 [Mini]: C47.1 LTC3.P$31(VREF)
N$283 [Mini]: IC1.11(VID) LTC1.P$43(SDO) R167.2 R168.2
N$284 [Mini]: R168.1 U$8.3
N$286 [Mini]: IC2_\.11(VID) LTC2.P$43(SDO) R165.2 R166.2
N$287 [Mini]: R166.1 U$9.3
N$288 [Mini]: LTC2.P$34(WDTB) U$9.2
N$289 [Mini]: LTC3.P$34(WDTB) U$10.2
N$290 [Mini]: IC3_.11(VID) LTC3.P$43(SDO) R163.2 R164.2
N$291: R164.1 U$10.3
PE [Mini]: C35.2 C36.2 C37.2 C38.2 C39.2 C40.2 C41.2 C42.2 C43.2 C44.2 C45.2 C46.2 C47.2 D43.A D44.A D45.A IC3_.9(GND2) IC3_.15(GND2) L44.2 LTC3.P$27(V-) LTC3.P$28(NC) LTC3.P$29(V_TEMP1) LTC3.P$30(V_TEMP2) LTC3.P$35(GPIO1) LTC3.P$36(GPIO2) LTC3_V-.P$1(TP) U$10.1 U$10.4 U$10.7 U$10.10 U$10.13 U$10.16
SCK_ISO1: IC1.3(VIA) LTC1_HEAD.7 LTC1_HEAD.8
SCK_ISO2: IC2_\.3(VIA) LTC2_HEAD.7 LTC2_HEAD.8
SCK_ISO3: IC3_.3(VIA) LTC3_HEAD.7 LTC3_HEAD.8
TOS [Mini]: LTC1.P$33(TOS) R5.1
V+ [Mini]: C2.1 IC1.10(VE2) IC1.16(VDD2) LTC1.P$32(VREG) R167.1 U$8.6 U$8.9 U$8.12 U$8.15 U$8.18
VCC [Mini]: C31.1 IC2_\.10(VE2) IC2_\.16(VDD2) LTC2.P$32(VREG) R165.1 U$9.6 U$9.9 U$9.12 U$9.15 U$9.18
VCC/2 [Mini]: C46.1 IC3_.10(VE2) IC3_.16(VDD2) LTC3.P$32(VREG) R163.1 U$10.6 U$10.9 U$10.12 U$10.15 U$10.18
WDTB [Mini]: LTC1.P$34(WDTB) U$8.2
Unconnected: LTC1.P$3(S12) LTC1.P$5(S11) LTC2.P$3(S12) LTC2.P$5(S11) LTC3.P$3(S12) LTC3.P$5(S11)

## Sheet 2 of 8: Power
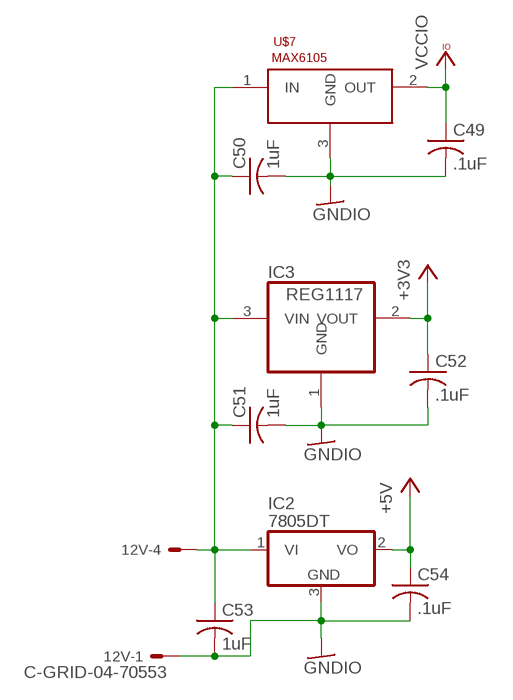
[diagram p5: schematic, sheet 2]

### Parts
12V  C-GRID-04-70553  [70553-04]
C49  .1uF  C-USC1206  [C1206]
C50  1uF  C-USC1206  [C1206]
C51  1uF  C-USC1206  [C1206]
C52  .1uF  C-USC1206  [C1206]
C53  1uF  C-USC1206  [C1206]
C54  .1uF  C-USC1206  [C1206]
IC2  7805DT  [TO252]
IC3  REG1117  [SOT223]
U$7  MAX6105  MAX6103  [SOT23]

### Nets
12V: 12V.4 C50.1 C51.1 C53.1 IC2.1(VI) IC3.3(VIN) U$7.1(IN) ; also sheet 4
+3V3: C52.1 IC3.2(VOUT) ; also sheet 3,6,8
+5V: C54.1 IC2.2(VO) ; also sheet 1,5,7
GNDIO: 12V.1 C49.2 C50.2 C51.2 C52.2 C53.2 C54.2 IC2.3(GND) IC3.1(GND) U$7.3(GND) ; also sheet 1,3,4,5,6,7,8
VCCIO: C49.1 U$7.2(OUT) ; also sheet 5
Unconnected: 12V.2 12V.3

## Sheet 3 of 8
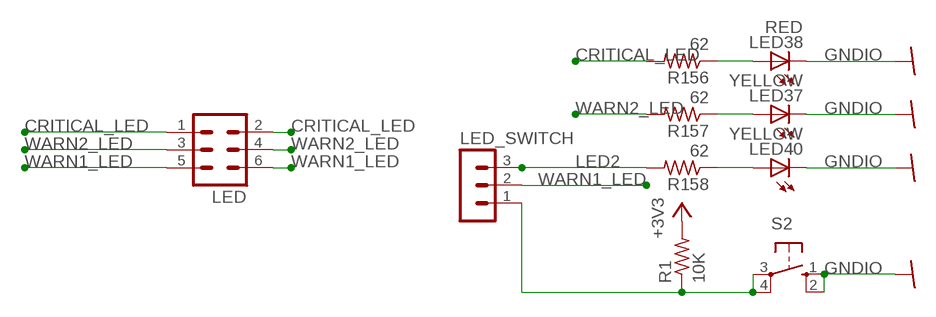
[diagram p6: schematic, sheet 3]

### Parts
LED  MA03-2  [MA03-2]
LED37  YELLOW  LEDCHIPLED_1206  [CHIPLED_1206]
LED38  RED  LEDCHIPLED_1206  [CHIPLED_1206]
LED40  YELLOW  LEDCHIPLED_1206  [CHIPLED_1206]
LED_SWITCH  MA03-1  [MA03-1]
R1  10K  R-US_R1206  [R1206]
R156  62  R-US_R1206  [R1206]
R157  62  R-US_R1206  [R1206]
R158  62  R-US_R1206  [R1206]
S2  10-XX  [B3F-10XX]

### Nets
+3V3: R1.2 ; also sheet 2,6,8
CRITICAL_LED: LED.1 LED.2 R156.2
GNDIO: LED37.C LED38.C LED40.C S2.1(S) S2.2(S1) ; also sheet 1,2,4,5,6,7,8
LED2: LED_SWITCH.3 R158.2
N$3: LED_SWITCH.1 R1.1 S2.3(P) S2.4(P1)
N$272: LED37.A R157.1
N$273: LED38.A R156.1
N$275: LED40.A R158.1
WARN1_LED: LED.5 LED.6 LED_SWITCH.2
WARN2_LED: LED.3 LED.4 R157.2

## Sheet 4 of 8: Relay
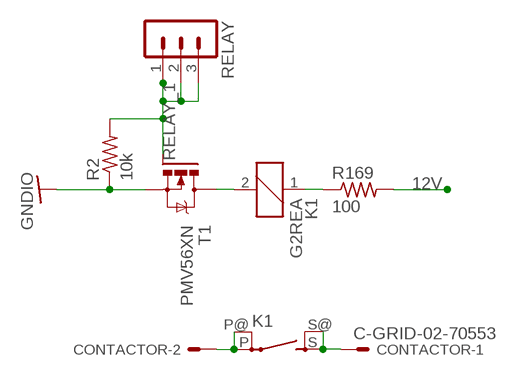
[diagram p7: schematic, sheet 4]

### Parts
CONTACTOR  C-GRID-02-70553  [70553-02]
K1  G2REA  [G2REA]
R2  10k  R-US_R1206  [R1206]
R169  100  R-US_R1206  [R1206]
RELAY  MA03-1  [MA03-1]
T1  PMV56XN  N-CHANNEL_MOSFETPMV56XN,215  [SOT23]

### Nets
12V: R169.2 ; also sheet 2
GNDIO: R2.1 T1.2(S) ; also sheet 1,2,3,5,6,7,8
N$4: K1.2 T1.3(D)
N$172: K1.1 R169.1
N$278: CONTACTOR.2 K1.P(2:P) K1.P@(2:P)
N$280: CONTACTOR.1 K1.S(2:S) K1.S@(2:S)
RELAY_1: R2.2 RELAY.1 RELAY.2 RELAY.3 T1.1(G)

## Sheet 5 of 8
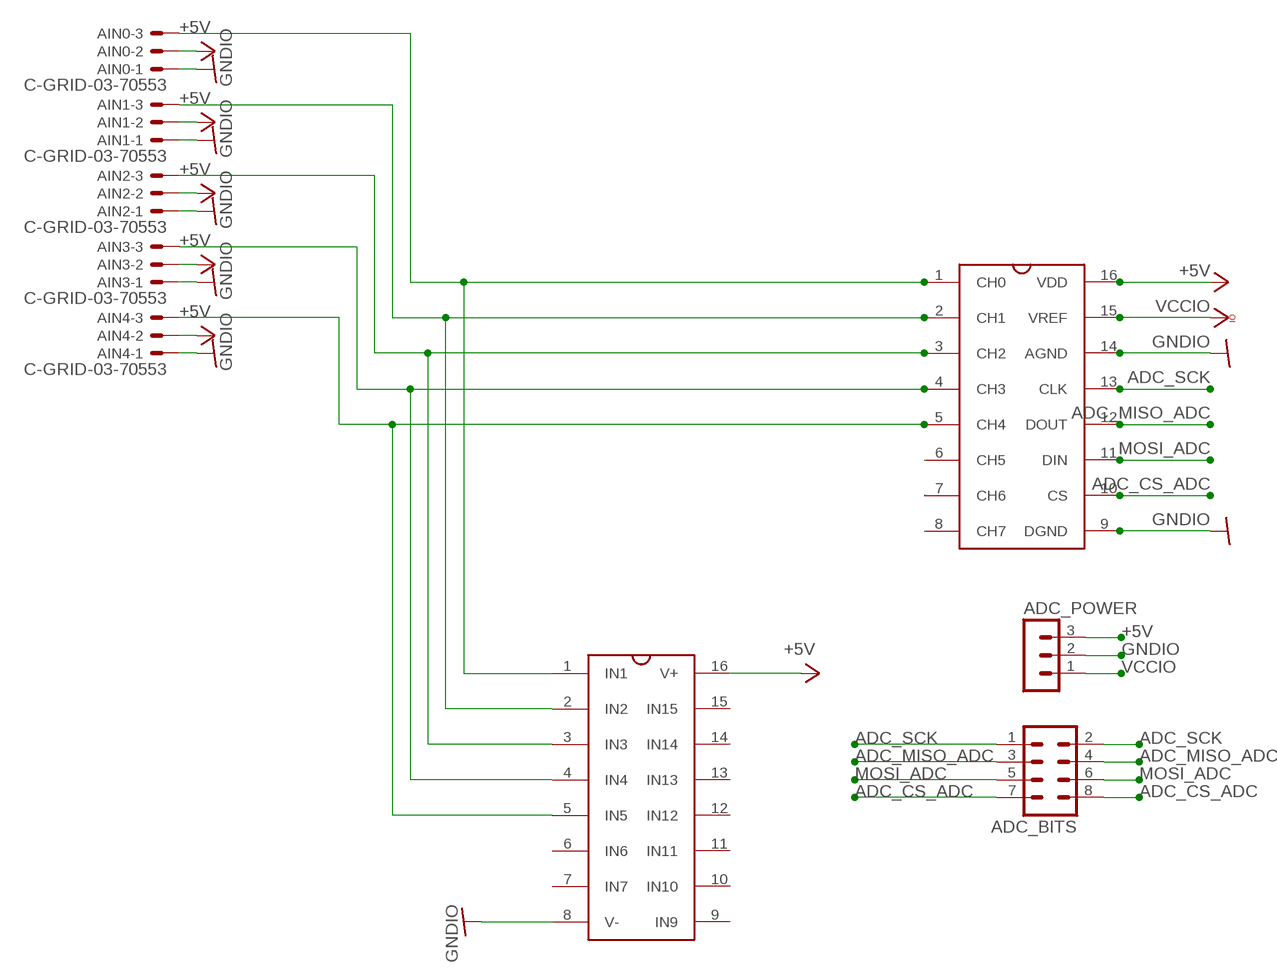
[diagram p8: schematic, sheet 5]

### Parts
ADC_BITS  MA04-2  [MA04-2]
ADC_POWER  MA03-1  [MA03-1]
AIN0  C-GRID-03-70553  [70553-03]
AIN1  C-GRID-03-70553  [70553-03]
AIN2  C-GRID-03-70553  [70553-03]
AIN3  C-GRID-03-70553  [70553-03]
AIN4  C-GRID-03-70553  [70553-03]
U$1  SP720APP  [SO16]
U$6  MCP-3008  [SO16]

### Nets
+5V: ADC_POWER.3 AIN0.2 AIN1.2 AIN2.2 AIN3.2 AIN4.2 U$1.16(V+) U$6.16(VDD) ; also sheet 1,2,7
ADC_CS_ADC: ADC_BITS.7 ADC_BITS.8 U$6.10(CS)
ADC_MISO_ADC: ADC_BITS.3 ADC_BITS.4 U$6.12(DOUT)
ADC_SCK: ADC_BITS.1 ADC_BITS.2 U$6.13(CLK)
GNDIO: ADC_POWER.2 AIN0.1 AIN1.1 AIN2.1 AIN3.1 AIN4.1 U$1.8(V-) U$6.9(DGND) U$6.14(AGND) ; also sheet 1,2,3,4,6,7,8
MOSI_ADC: ADC_BITS.5 ADC_BITS.6 U$6.11(DIN)
N$7: U$6.8(CH7)
N$42: U$6.7(CH6)
N$266: U$6.6(CH5)
N$267: AIN0.3 U$1.1(IN1) U$6.1(CH0)
N$268: AIN1.3 U$1.2(IN2) U$6.2(CH1)
N$269: AIN2.3 U$1.3(IN3) U$6.3(CH2)
N$270: AIN3.3 U$1.4(IN4) U$6.4(CH3)
N$271: AIN4.3 U$1.5(IN5) U$6.5(CH4)
VCCIO: ADC_POWER.1 U$6.15(VREF) ; also sheet 2
Unconnected: U$1.6(IN6) U$1.7(IN7) U$1.9(IN9) U$1.10(IN10) U$1.11(IN11) U$1.12(IN12) U$1.13(IN13) U$1.14(IN14) U$1.15(IN15)

## Sheet 6 of 8: PIC
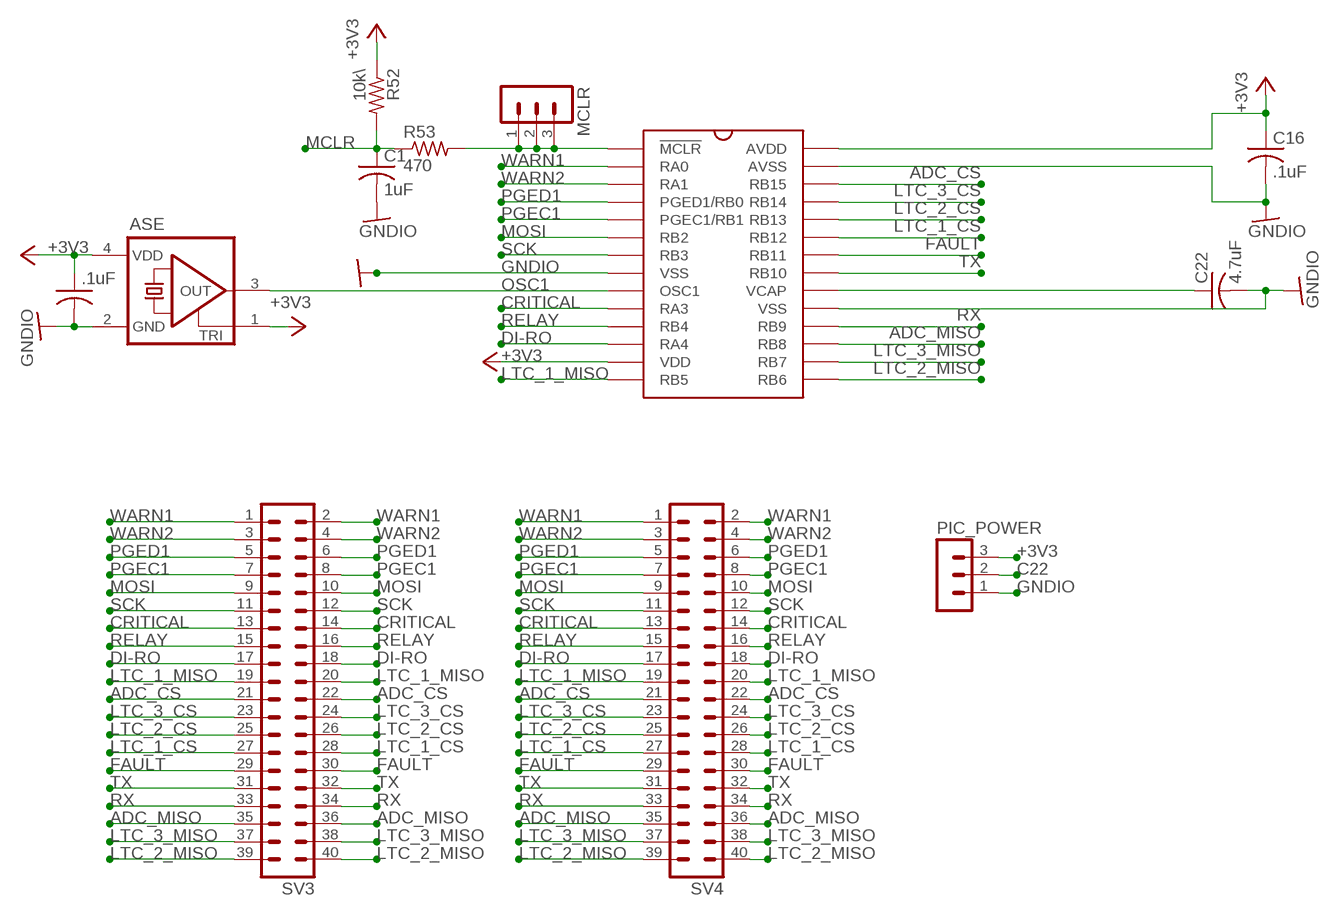
[diagram p9: schematic, sheet 6]

### Parts
C1  1uF  C-USC1206  [C1206]
C16  .1uF  C-USC1206  [C1206]
C22  4.7uF  C-USC1206  [C1206]
C48  .1uF  C-USC1206  [C1206]
MCLR  MA03-1  [MA03-1]
PIC_POWER  MA03-1  [MA03-1]
R52  10k\  R-US_R1206  [R1206]
R53  470  R-US_R1206  [R1206]
SV3  MA20-2  [MA20-2]
SV4  MA20-2  [MA20-2]
U$2  PIC24HJ128GP-202  [SO28W]
U$3  ASE  [ASE]

### Nets
+3V3: C16.1 C48.1 PIC_POWER.3 R52.1 U$2.13(VDD) U$2.28(AVDD) U$3.1(TRI) U$3.4(VDD) ; also sheet 2,3,8
ADC_CS: SV3.21 SV3.22 SV4.21 SV4.22 U$2.26(RB15)
ADC_MISO: SV3.35 SV3.36 SV4.35 SV4.36 U$2.17(RB8)
C22: C22.1 PIC_POWER.2 U$2.20(VCAP)
CRITICAL: SV3.13 SV3.14 SV4.13 SV4.14 U$2.10(RA3)
DI-RO: SV3.17 SV3.18 SV4.17 SV4.18 U$2.12(RA4)
FAULT: SV3.29 SV3.30 SV4.29 SV4.30 U$2.22(RB11)
GNDIO: C1.2 C16.2 C22.2 C48.2 PIC_POWER.1 U$2.8(VSS) U$2.19(VSS) U$2.27(AVSS) U$3.2(GND) ; also sheet 1,2,3,4,5,7,8
LTC_1_CS: SV3.27 SV3.28 SV4.27 SV4.28 U$2.23(RB12)
LTC_1_MISO: SV3.19 SV3.20 SV4.19 SV4.20 U$2.14(RB5)
LTC_2_CS: SV3.25 SV3.26 SV4.25 SV4.26 U$2.24(RB13)
LTC_2_MISO: SV3.39 SV3.40 SV4.39 SV4.40 U$2.15(RB6)
LTC_3_CS: SV3.23 SV3.24 SV4.23 SV4.24 U$2.25(RB14)
LTC_3_MISO: SV3.37 SV3.38 SV4.37 SV4.38 U$2.16(RB7)
MCLR: C1.1 R52.2 R53.1 ; also sheet 8
MOSI: SV3.9 SV3.10 SV4.9 SV4.10 U$2.6(RB2)
N$1: MCLR.1 MCLR.2 MCLR.3 R53.2 U$2.1(!MCLR!)
OSC1: U$2.9(OSC1) U$3.3(OUT) ; also sheet 8
PGEC1: SV3.7 SV3.8 SV4.7 SV4.8 U$2.5(PGEC1/RB1) ; also sheet 8
PGED1: SV3.5 SV3.6 SV4.5 SV4.6 U$2.4(PGED1/RB0) ; also sheet 8
RELAY: SV3.15 SV3.16 SV4.15 SV4.16 U$2.11(RB4)
RX: SV3.33 SV3.34 SV4.33 SV4.34 U$2.18(RB9)
SCK: SV3.11 SV3.12 SV4.11 SV4.12 U$2.7(RB3)
TX: SV3.31 SV3.32 SV4.31 SV4.32 U$2.21(RB10)
WARN1: SV3.1 SV3.2 SV4.1 SV4.2 U$2.2(RA0)
WARN2: SV3.3 SV3.4 SV4.3 SV4.4 U$2.3(RA1)

## Sheet 7 of 8: RS-485
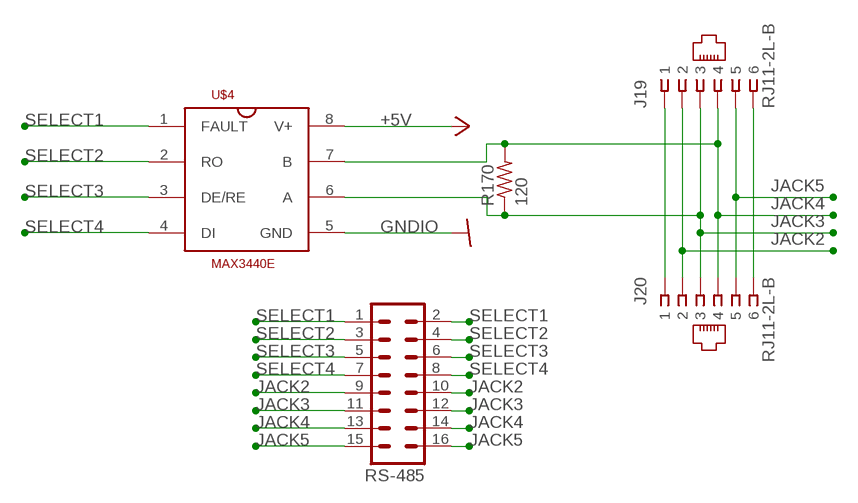
[diagram p10: schematic, sheet 7]

### Parts
J19  RJ11-2L-B  [RJ11-NO_SHIELD]
J20  RJ11-2L-B  [RJ11-NO_SHIELD]
R170  120  R-US_R1206  [R1206]
RS-485  MA08-2  [MA08-2]
U$4  MAX3440E  [SO-08]

### Nets
+5V: U$4.8(V+) ; also sheet 1,2,5
GNDIO: U$4.5(GND) ; also sheet 1,2,3,4,5,6,8
JACK2: J19.2 J20.2 RS-485.9 RS-485.10
JACK3: J19.3 J20.3 R170.1 RS-485.11 RS-485.12 U$4.6(A)
JACK4: J19.4 J20.4 R170.2 RS-485.13 RS-485.14 U$4.7(B)
JACK5: J19.5 J20.5 RS-485.15 RS-485.16
N$6: J19.1 J20.1
N$18: J19.6 J20.6
SELECT1: RS-485.1 RS-485.2 U$4.1(FAULT)
SELECT2: RS-485.3 RS-485.4 U$4.2(RO)
SELECT3: RS-485.5 RS-485.6 U$4.3(DE/RE)
SELECT4: RS-485.7 RS-485.8 U$4.4(DI)

## Sheet 8 of 8
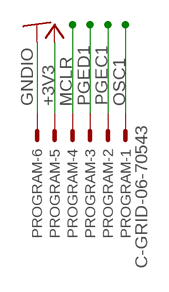
[diagram p11: schematic, sheet 8]

### Parts
PROGRAM  C-GRID-06-70543  [70543-06]

### Nets
+3V3: PROGRAM.5 ; also sheet 2,3,6
GNDIO: PROGRAM.6 ; also sheet 1,2,3,4,5,6,7
MCLR: PROGRAM.4 ; also sheet 6
OSC1: PROGRAM.1 ; also sheet 6
PGEC1: PROGRAM.2 ; also sheet 6
PGED1: PROGRAM.3 ; also sheet 6

## Library data of the parts
12V = con-molex:C-GRID-04: CONNECTOR wire to board 2.54 mm (0.100") pitch header; OC_FARNELL: unknown; OC_NEWARK: unknown
ADC_BITS = con-lstb:MA04-2: PIN HEADER; OC_FARNELL: unknown; OC_NEWARK: unknown
ADC_POWER LED_SWITCH MCLR PIC_POWER RELAY = con-lstb:MA03-1: PIN HEADER; OC_FARNELL: unknown; OC_NEWARK: unknown
AIN0 AIN1-AIN4 = con-molex:C-GRID-03: CONNECTOR wire to board 2.54 mm (0.100") pitch header; OC_FARNELL: unknown; OC_NEWARK: unknown
C1 C2 C4-C16 C19-C32 C35-C54 = rcl:C-US: CAPACITOR, American symbol
CELLS-11-20 CELLS-21-30 = con-molex:C-GRID-10: CONNECTOR wire to board 2.54 mm (0.100") pitch header; OC_FARNELL: unknown; OC_NEWARK: unknown
CONTACTOR = con-molex:C-GRID-02: CONNECTOR wire to board 2.54 mm (0.100") pitch header; OC_FARNELL: unknown; OC_NEWARK: unknown
D4 D6-D30 D33-D45 = diode:DIODE-: DIODE
GND-10 = con-molex:C-GRID-11: CONNECTOR wire to board 2.54 mm (0.100") pitch header; OC_FARNELL: unknown; OC_NEWARK: unknown
IC1 IC2_\ IC3_ = adum140x:ADUM1401
IC2 = linear:78*: Positive VOLTAGE REGULATOR Source: http://cache.national.com/ds/LM/LM78L05.pdf http://www.fairchildsemi.com/ds/LM/LM7805.pdf
IC3 = burr-brown:REG1117: 800mA and 1A Low Dropout (LDO) Positive Regulator 1.8V, 2.5V, 2.85V, 3.3V, 5V, and Adj; MPN: REG1117; OC_FARNELL: 1097566; OC_NEWARK: 14P6981
J19 J20 = con-tycoelectronics:RJ11: CORCOM Modular RJ Jacks No Shield Source: www.tycoelectronics.com .. ENG_DS_1654001_1099_RJ_L_0507.pdf; MF: TYCO ELECTRONICS; MPN: RJ11-2L-B; OC_FARNELL: unknown; OC_NEWARK: 83F4463
K1 = relay:G2REA: RELAY 1 x norm. open, high current, Omron; OC_FARNELL: unknown; OC_NEWARK: unknown
L5-L30 L33-L45 = rcl:L-US: INDUCTOR, American symbol
LED = con-lstb:MA03-2: PIN HEADER; OC_FARNELL: unknown; OC_NEWARK: unknown
LED37 LED38 LED40 = led:LED: LED OSRAM: - CHIPLED LG R971, LG N971, LY N971, LG Q971, LY Q971, LO R971, LY R971 LH N974, LH R974 LS Q976, LO Q976, LY Q976 LO Q996 - Hyper CHIPLED LW Q18S LB Q993, LB Q99A, LB R99A - SideLED LS A670, LO A670, LY A670, LG A670, LP A670 LB A673, LV A673, LT A673, LW A673 LH A674 LY A675 LS A676, LA A676, LO A676, LY A676, LW A676 LS A679, LY A679, LG A679 - Hyper Micro SIDELED® LS Y876, LA Y876, LO Y876, LY Y876 LT Y87S - SmartLED LW L88C, LW L88S LB L89C, LB L89S, LG L890 LS L89K, LO L89K, LY L89K LS L896, LA L896, LO L896, LY L896 - TOPLED LS T670, LO T670, LY T670, LG T670, LP T670 LSG T670, LSP T670, LSY T670, LOP T670, LYG T670 LG T671, LOG T671, LSG T671 LB T673, LV T673, LT T673, LW T673 LH T674 LS T676, LA T676, LO T676, LY T676, LB T676, LH T676, LSB T676, LW T676 LB T67C, LV T67C, LT T67C, LS T67K, LO T67K, LY T67K, LW E67C LS E67B, LA E67B, LO E67B, LY E67B, LB E67C, LV E67C, LT E67C LW T67C LS T679, LY T679, LG T679 LS T770, LO T770, LY T770, LG T770, LP T770 LB T773, LV T773, LT T773, LW T773 LH T774 LS E675, LA E675, LY E675, LS T675 LS T776, LA T776, LO T776, LY T776, LB T776 LHGB T686 LT T68C, LB T68C - Hyper Mini TOPLED® LB M676 - Mini TOPLED Santana® LG M470 LS M47K, LO M47K, LY M47K Source: http://www.osram.convergy.de LUXEON: - LUMILED® LXK2-PW12-R00, LXK2-PW12-S00, LXK2-PW14-U00, LXK2-PW14-V00 LXK2-PM12-R00, LXK2-PM12-S00, LXK2-PM14-U00 LXK2-PE12-Q00, LXK2-PE12-R00, LXK2-PE12-S00, LXK2-PE14-T00, LXK2-PE14-U00 LXK2-PB12-K00, LXK2-PB12-L00, LXK2-PB12-M00, LXK2-PB14-N00, LXK2-PB14-P00, LXK2-PB14-Q00 LXK2-PR12-L00, LXK2-PR12-M00, LXK2-PR14-Q00, LXK2-PR14-R00 LXK2-PD12-Q00, LXK2-PD12-R00, LXK2-PD12-S00 LXK2-PH12-R00, LXK2-PH12-S00 LXK2-PL12-P00, LXK2-PL12-Q00, LXK2-PL12-R00 Source: www.luxeon.com KINGBRIGHT: KA-3528ASYC Source: www.kingbright.com
LTC1-LTC3 = LTC6803:LTC6803-4
LTC1_C0 LTC1_C1-LTC1_C10 LTC1_S1-LTC1_S10 LTC1_V+ LTC1_V- LTC2_C0 LTC2_C1-LTC2_C10 LTC2_S1-LTC2_S10 LTC2_V+ LTC2_V- LTC3_C0 LTC3_C1-LTC3_C10 LTC3_S1-LTC3_S10 LTC3_V+ LTC3_V- = LTC6803:TESTPAD-20MIL
LTC1_HEAD LTC2_HEAD LTC3_HEAD = con-lstb:MA06-2: PIN HEADER; OC_FARNELL: unknown; OC_NEWARK: unknown
PROGRAM = con-molex:C-GRID-06: CONNECTOR wire to board 2.54 mm (0.100") pitch header; OC_FARNELL: unknown; OC_NEWARK: unknown
Q3-Q12 Q15-Q24 Q27-Q36 = transistor-power:IRLML5203: HEXFET P-Channel Power MOSFET
R1 R2 R5 R10-R12 R14-R16 R18-R20 R22-R24 R26-R28 R30-R32 R34-R36 R38-R40 R42-R44 R46-R48 R50-R53 R62-R64 R66-R68 R70-R72 R74-R76 R78-R80 R82-R84 R86-R88 R90-R92 R94-R96 R98-R100 R102-R104 R113-R115 R117-R119 R121-R123 R125-R127 R129-R131 R133-R135 R137-R139 R141-R143 R145-R147 R149-R151 R153-R158 R169 R170 = rcl:R-US_: RESISTOR, American symbol
R163-R168 = resistor:R-US_: RESISTOR, American symbol
RS-485 = con-lstb:MA08-2: PIN HEADER; OC_FARNELL: unknown; OC_NEWARK: unknown
S2 = switch-omron:10-XX: OMRON SWITCH; MPN: B3F-1000; OC_FARNELL: 176432; OC_NEWARK: 36M3542
SV3 SV4 = con-lstb:MA20-2: PIN HEADER; OC_FARNELL: unknown; OC_NEWARK: unknown
T1 = SolarJacketsADC:N-CHANNEL_MOSFET; PART_NUM: PMV56XN,215
U$1 = SolarJackets_Common:SP720APP
U$2 = LTC6803:PIC24HJ128GP-202
U$3 = crystal:ASE: 3.3Vdc CMOS SMD CRYSTAL CLOCK OSCILLATOR SOurce: www.abracon.com; OC_FARNELL: unknown; OC_NEWARK: unknown
U$4 = SolarJackets:MAX3440E
U$6 = SolarJackets_Common:MCP-3008
U$7 = SolarJackets_Common:MAX6103
U$8-U$10 = SolarJackets_Common:3ROW_6POS

## Net classes
0 default: width 0.254 mm
1 Mini: width 0.203 mm